# EAGLE design lola (EAGLE 9.6.1)

## Sheet 1 of 4: MCU
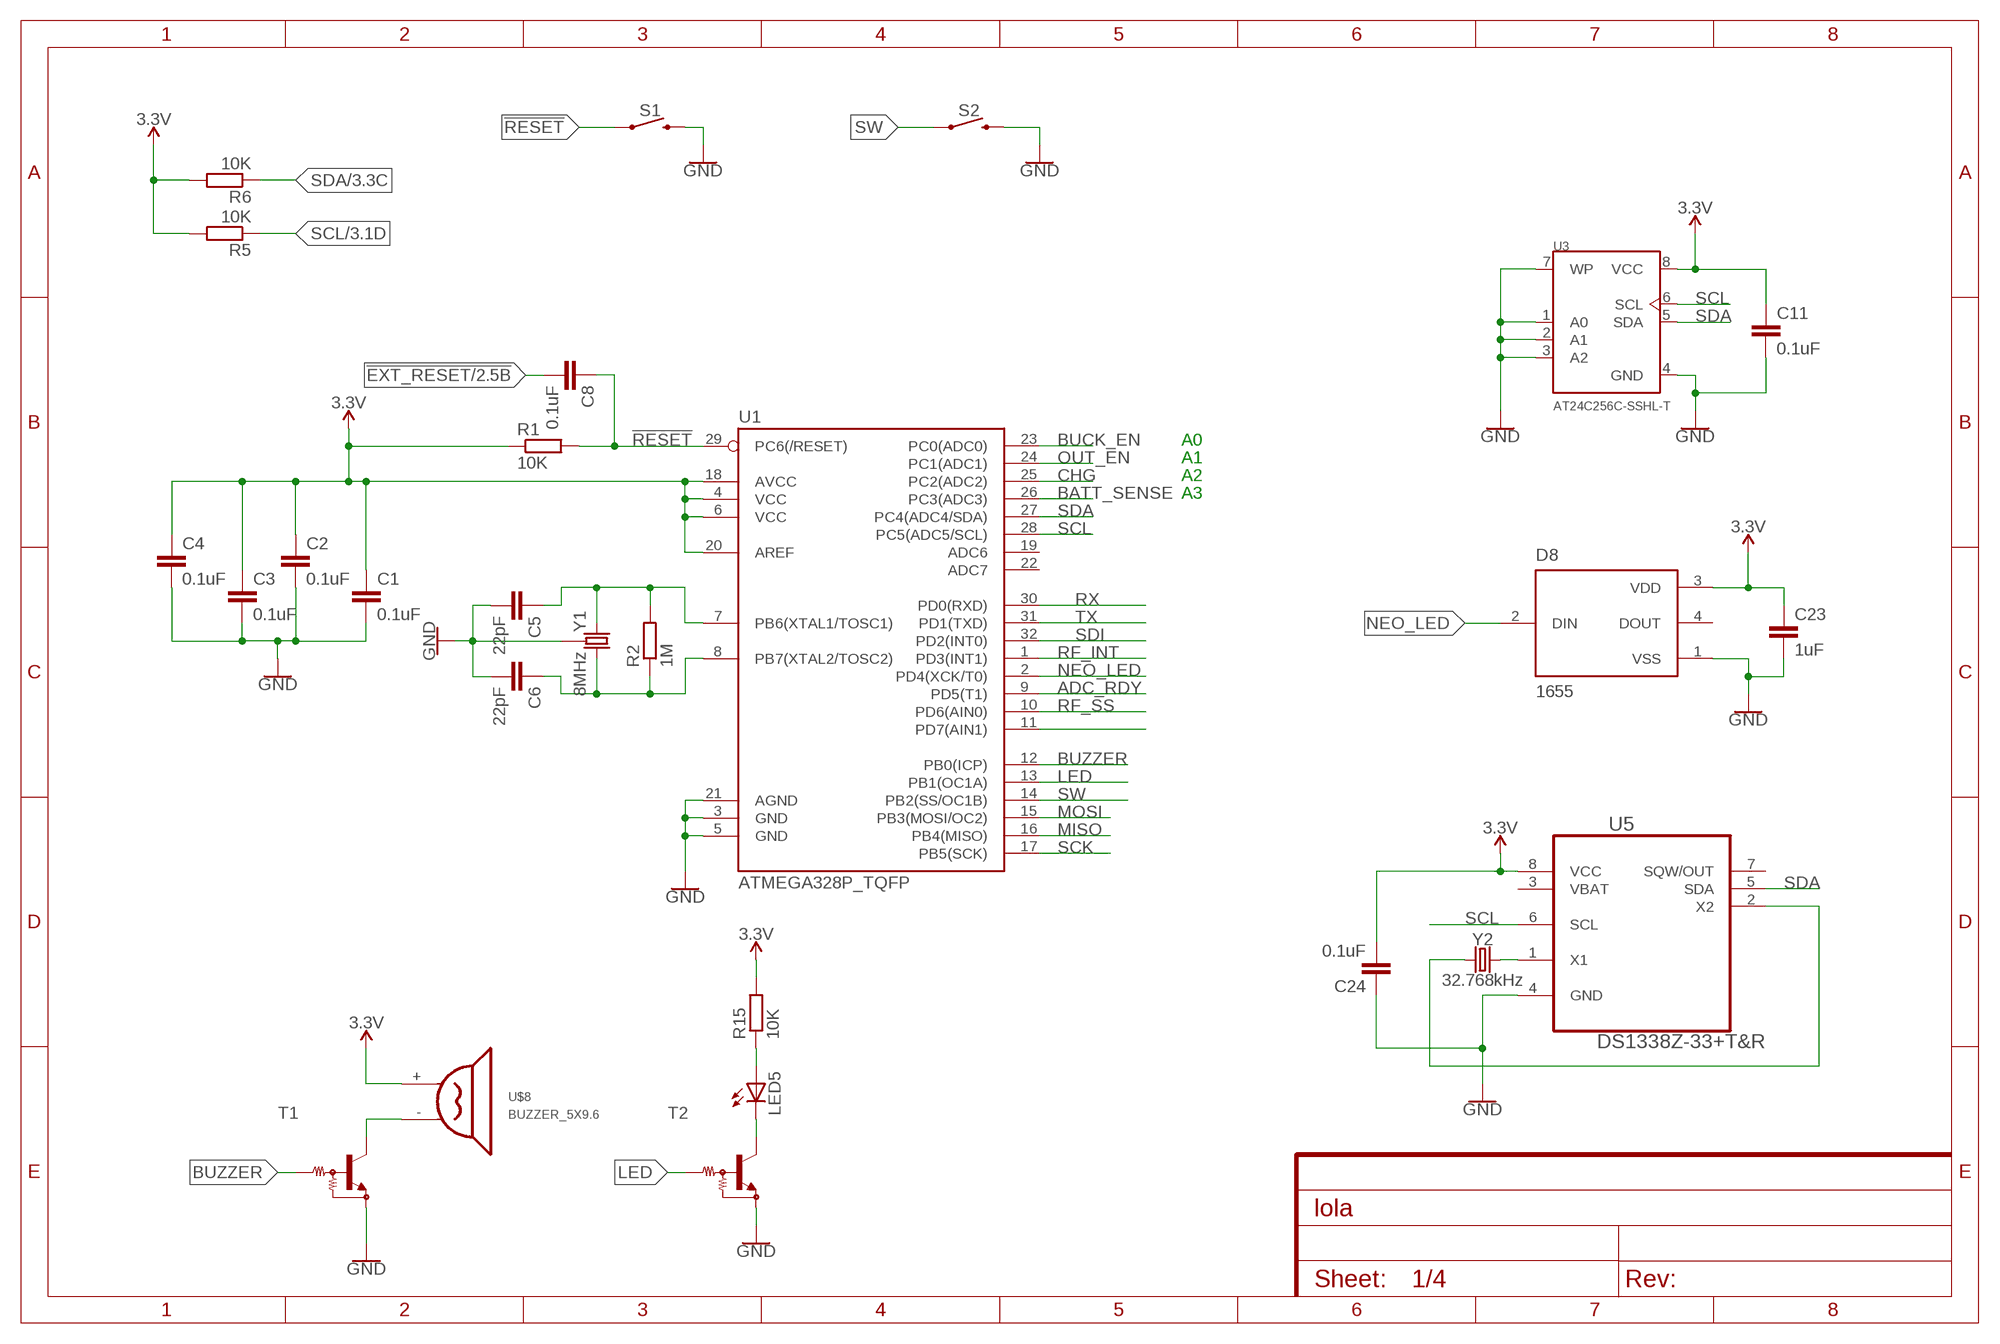
[diagram p0: schematic, sheet 1]

### Parts
C1  0.1uF  C-EUC0603  [C0603]
C2  0.1uF  C-EUC0603  [C0603]
C3  0.1uF  C-EUC0603  [C0603]
C4  0.1uF  C-EUC0603  [C0603]
C5  22pF  C-EUC0603  [C0603]
C6  22pF  C-EUC0603  [C0603]
C8  0.1uF  C-EUC0603  [C0603]
C11  0.1uF  C-EUC0603  [C0603]
C23  1uF  C-EUC0603  [C0603]
C24  0.1uF  C-EUC0603  [C0603]
D8  1655  [LED_1655]
LED5  LEDCHIPLED_0805  [CHIPLED_0805]
R1  10K  R-EU_R0603  [R0603]
R2  1M  R-EU_R0603  [R0603]
R5  10K  R-EU_R0603  [R0603]
R6  10K  R-EU_R0603  [R0603]
R15  10K  R-EU_R0603  [R0603]
S1  MOMENTARY-SWITCH-SPST-SMD-4.6X2.8MM  [TACTILE_SWITCH_SMD_4.6X2.8MM]
S2  MOMENTARY-SWITCH-SPST-SMD-4.6X2.8MM  [TACTILE_SWITCH_SMD_4.6X2.8MM]
T1  MUN2211T1-NPN_DRIVER-SC59-BEC  [SC59-BEC]
T2  MUN2211T1-NPN_DRIVER-SC59-BEC  [SC59-BEC]
U1  ATMEGA328P_TQFP  [TQFP32-08]
U3  AT24C256C-SSHL-T  [SOIC127P600X175-8N]
U5  DS1338Z-33+T&R  [SOIC127P600X175-8N]
U$8  BUZZER_5X9.6  [BUZZER_5X9.6]
Y1  8MHz  CRYSTAL-GROUNDEDSMD-5X3.2  [CRYSTAL-SMD-5X3.2-4PAD]
Y2  32.768kHz  CRYSTAL-32.768KHZSMD-3.2X1.5  [CRYSTAL-SMD-3.2X1.5MM]

### Nets
3.3V: C1.1 C2.1 C3.1 C4.1 C11.1 C23.1 C24.2 D8.3(VDD) R1.1 R5.2 R6.2 R15.2 U1.4(VCC) U1.6(VCC) U1.18(AVCC) U1.20(AREF) U3.8(VCC) U5.8(VCC) U$8.+(VCC) ; also sheet 3,4
!EXT_RESET: C8.2 ; also sheet 2
!RESET: C8.1 R1.2 S1.1 S1.2 U1.29(PC6(/RESET)) ; also sheet 3
ADC_RDY: U1.9(PD5(T1)) ; also sheet 3
BATT_SENSE: U1.26(PC3(ADC3)) ; also sheet 4
BUCK_EN: U1.23(PC0(ADC0)) ; also sheet 4
BUZZER: T1.B U1.12(PB0(ICP))
CHG: U1.25(PC2(ADC2)) ; also sheet 4
GND: C1.2 C2.2 C3.2 C4.2 C5.2 C6.2 C11.2 C23.2 C24.1 D8.1(VSS) S1.3 S1.4 S2.3 S2.4 T1.E T2.E U1.3(GND) U1.5(GND) U1.21(AGND) U3.1(A0) U3.2(A1) U3.3(A2) U3.4(GND) U3.7(WP) U5.4(GND) Y1.2 Y1.4 ; also sheet 2,3,4
LED: T2.B U1.13(PB1(OC1A))
MISO: U1.16(PB4(MISO)) ; also sheet 3
MOSI: U1.15(PB3(MOSI/OC2)) ; also sheet 3
N$4: LED5.A R15.1
N$6: U5.1(X1) Y2.P$2
N$7: U5.2(X2) Y2.P$1
N$9: LED5.C T2.C
N$11: T1.C U$8.-(GND)
N$13: U1.11(PD7(AIN1))
N$17: C5.1 R2.2 U1.7(PB6(XTAL1/TOSC1)) Y1.3
N$18: C6.1 R2.1 U1.8(PB7(XTAL2/TOSC2)) Y1.1
NEO_LED: D8.2(DIN) U1.2(PD4(XCK/T0))
OUT_EN: U1.24(PC1(ADC1)) ; also sheet 3,4
RF_INT: U1.1(PD3(INT1)) ; also sheet 3
RF_SS: U1.10(PD6(AIN0)) ; also sheet 3
RX: U1.30(PD0(RXD)) ; also sheet 2
SCK: U1.17(PB5(SCK)) ; also sheet 3
SCL: R5.1 U1.28(PC5(ADC5/SCL)) U3.6(SCL) U5.6(SCL) ; also sheet 3
SDA: R6.1 U1.27(PC4(ADC4/SDA)) U3.5(SDA) U5.5(SDA) ; also sheet 3
SDI: U1.32(PD2(INT0)) ; also sheet 3
SW: S2.1 S2.2 U1.14(PB2(SS/OC1B))
TX: U1.31(PD1(TXD)) ; also sheet 2
Unconnected: D8.4(DOUT) U1.19(ADC6) U1.22(ADC7) U5.7(SQW/OUT)

### Notes on the sheet
- A0
- A1
- A2
- A3

## Sheet 2 of 4: USART
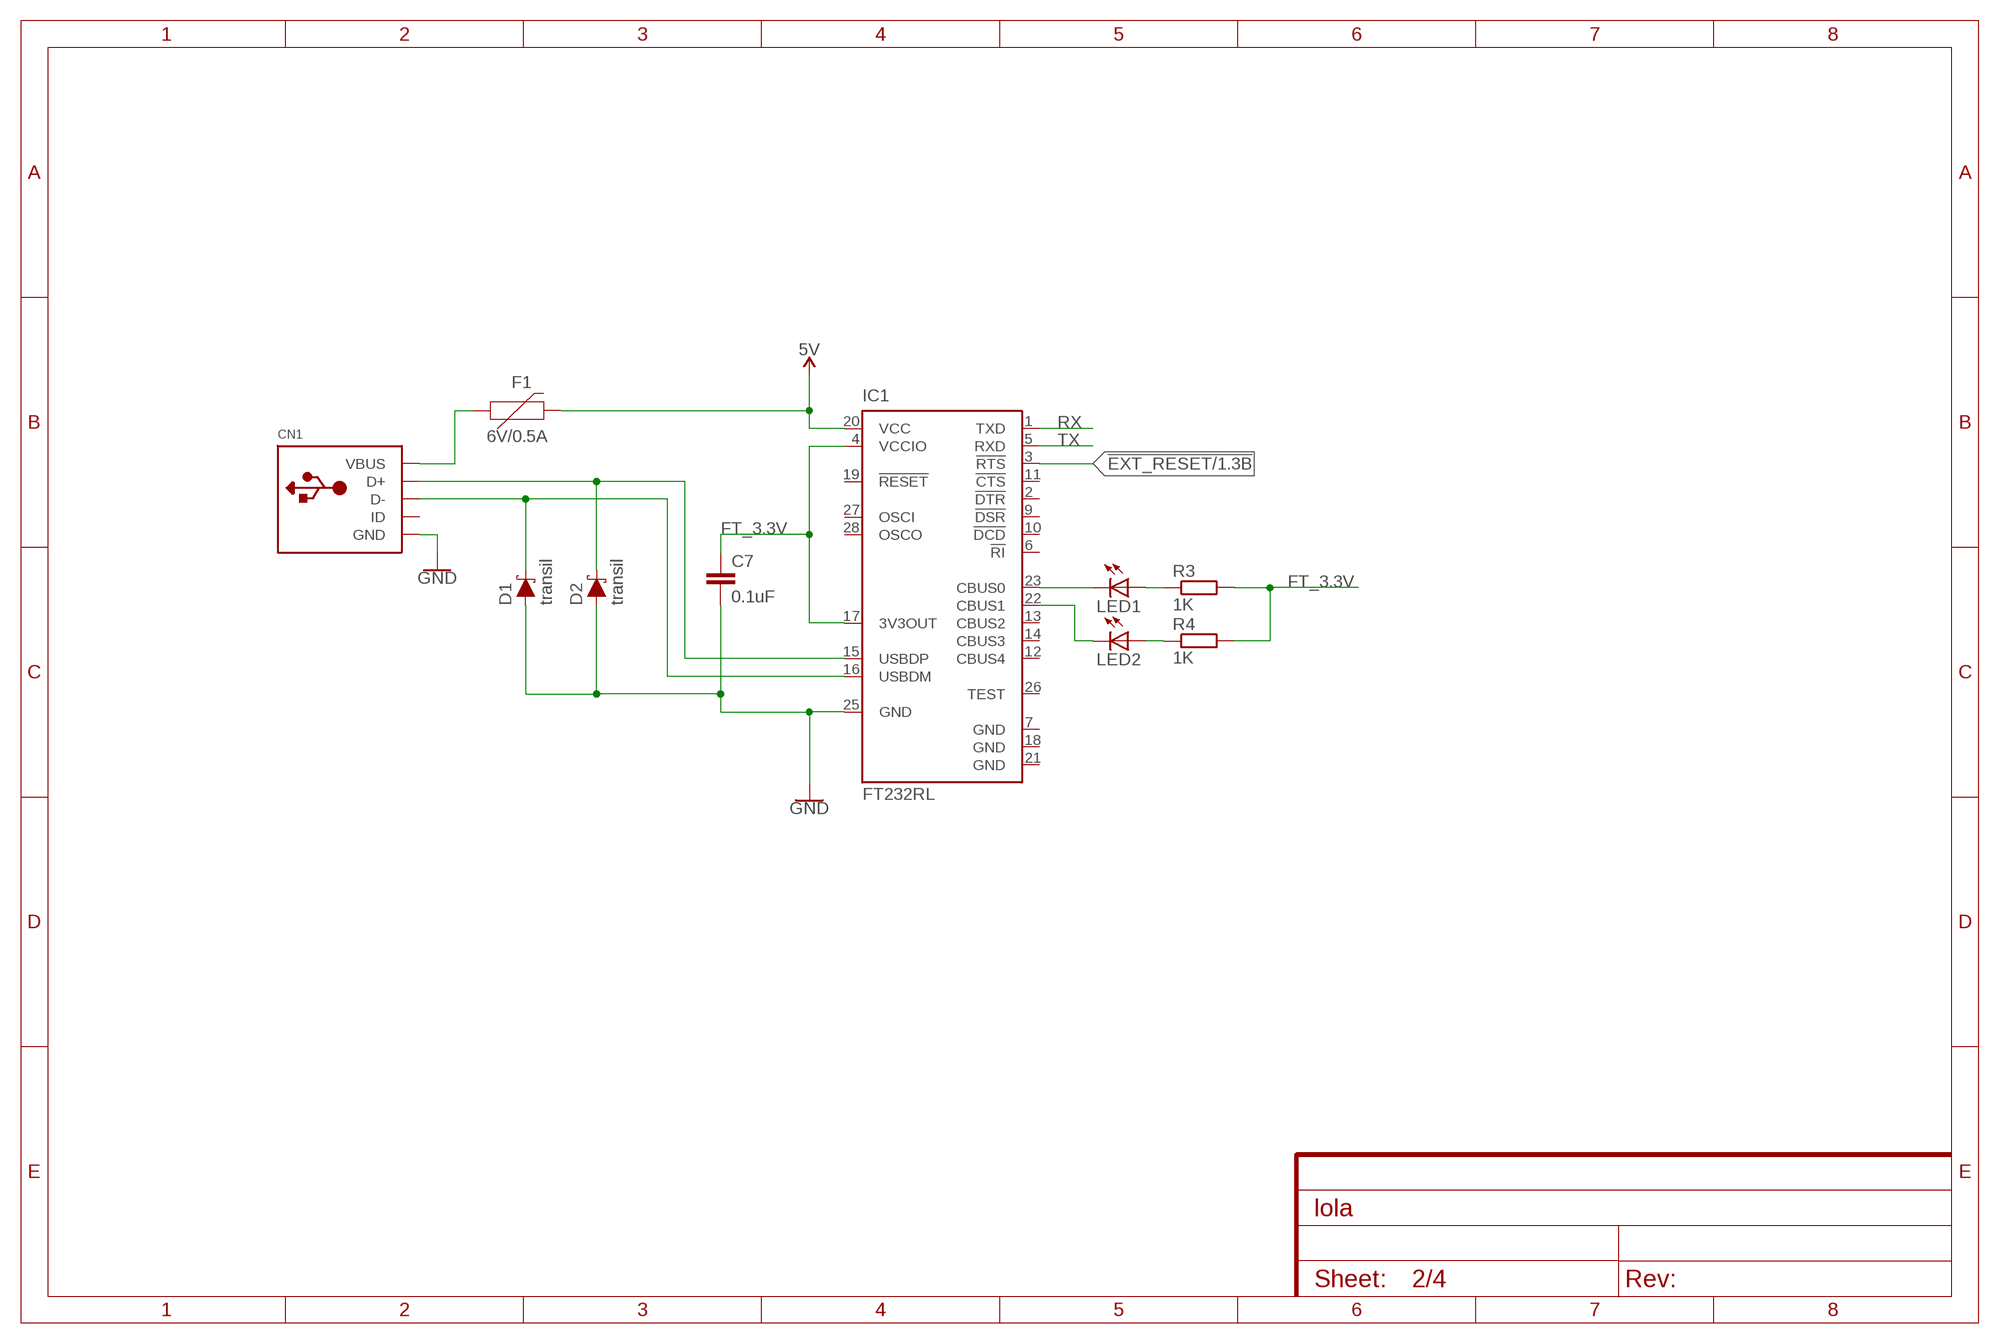
[diagram p1: schematic, sheet 2]

### Parts
C7  0.1uF  C-EUC0603  [C0603]
CN1  USBMINIB  [USB-MINIB]
D1  transil  DIODE-SCHOTTKY-BAT20J  [SOD-323]
D2  transil  DIODE-SCHOTTKY-BAT20J  [SOD-323]
F1  6V/0.5A  PPTC_HALF-AMP  [1206]
IC1  FT232RL  [SSOP28]
LED1  LEDCHIPLED_0805  [CHIPLED_0805]
LED2  LEDCHIPLED_0805  [CHIPLED_0805]
R3  1K  R-EU_R0603  [R0603]
R4  1K  R-EU_R0603  [R0603]

### Nets
5V: F1.2 IC1.20(VCC) ; also sheet 4
!EXT_RESET: IC1.3(!RTS) ; also sheet 1
FT_3.3V: C7.1 IC1.4(VCCIO) IC1.17(3V3OUT) R3.2 R4.2
GND: C7.2 CN1.GND D1.A D2.A IC1.25(GND) ; also sheet 1,3,4
N$20: CN1.VBUS F1.1
N$21: CN1.D+ D2.C IC1.15(USBDP)
N$22: CN1.D- D1.C IC1.16(USBDM)
N$23: LED2.A R4.1
N$24: IC1.22(CBUS1) LED2.C
N$25: IC1.23(CBUS0) LED1.C
N$26: LED1.A R3.1
RX: IC1.1(TXD) ; also sheet 1
TX: IC1.5(RXD) ; also sheet 1
Unconnected: CN1.ID IC1.2(!DTR) IC1.6(!RI) IC1.9(!DSR) IC1.10(!DCD) IC1.11(!CTS) IC1.12(CBUS4) IC1.13(CBUS2) IC1.14(CBUS3) IC1.19(!RESET) IC1.26(TEST) IC1.27(OSCI) IC1.28(OSCO)

## Sheet 3 of 4: Modules
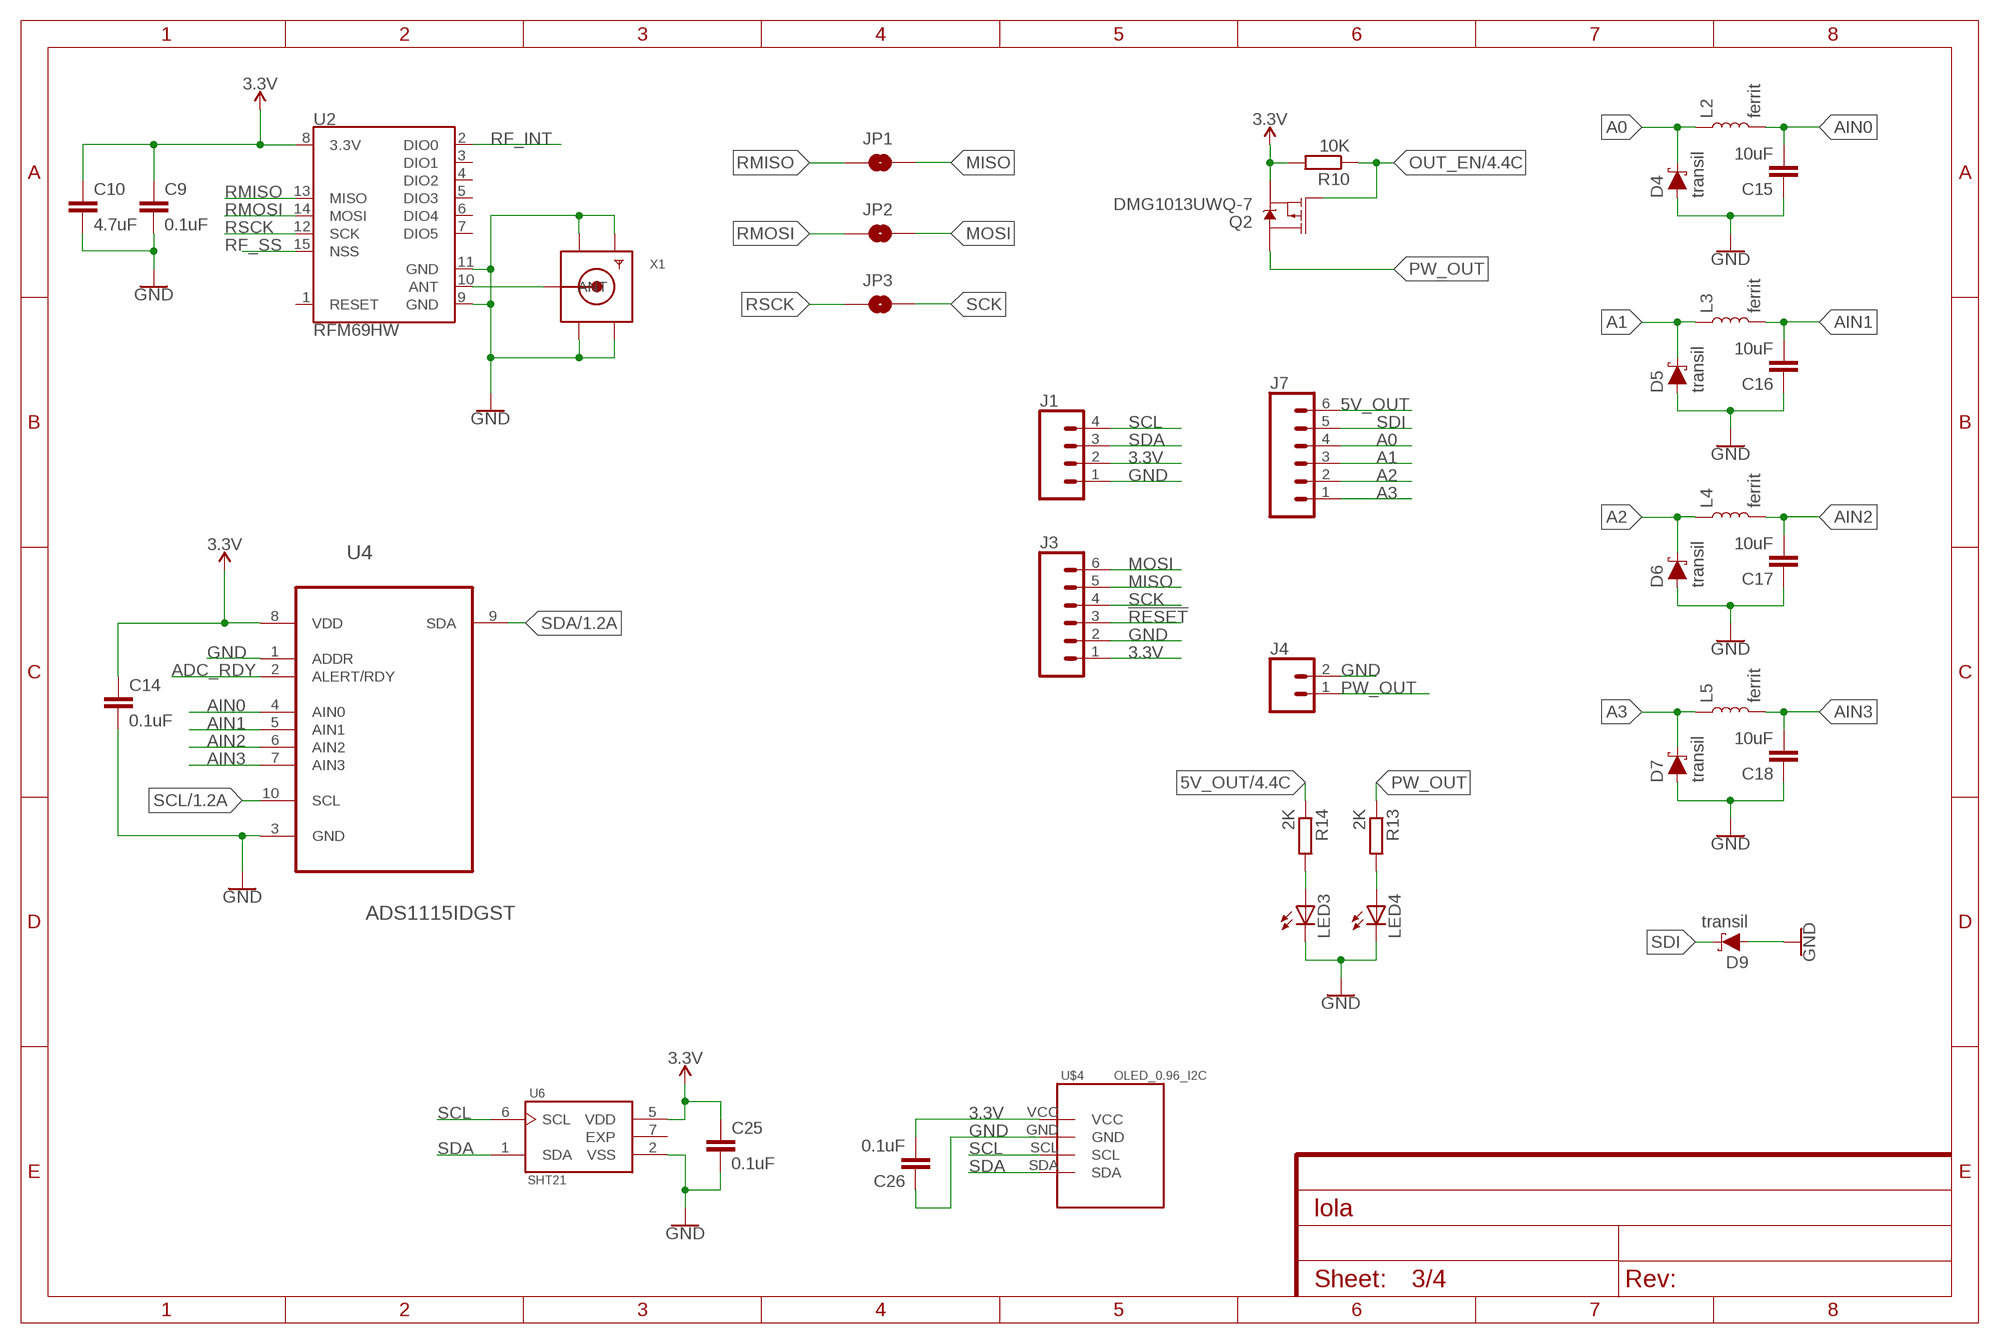
[diagram p2: schematic, sheet 3]

### Parts
C9  0.1uF  C-EUC0603  [C0603]
C10  4.7uF  C-EUC0603  [C0603]
C14  0.1uF  C-EUC0603  [C0603]
C15  10uF  C-EUC0603  [C0603]
C16  10uF  C-EUC0603  [C0603]
C17  10uF  C-EUC0603  [C0603]
C18  10uF  C-EUC0603  [C0603]
C25  0.1uF  C-EUC0603  [C0603]
C26  0.1uF  C-EUC0603  [C0603]
D4  transil  DIODE-SCHOTTKY-BAT20J  [SOD-323]
D5  transil  DIODE-SCHOTTKY-BAT20J  [SOD-323]
D6  transil  DIODE-SCHOTTKY-BAT20J  [SOD-323]
D7  transil  DIODE-SCHOTTKY-BAT20J  [SOD-323]
D9  transil  DIODE-SCHOTTKY-BAT20J  [SOD-323]
J1  CONN_04LOCK_LONGPADS  [1X04_LOCK_LONGPADS]
J3  CONN_06NO_SILK_FEMALE_PTH  [1X06_NO_SILK]
J4  CONN_025MM  [SCREWTERMINAL-5MM-2]
J7  CONN_063.5MM-6  [SCREWTERMINAL-3.5MM-6]
JP1  JUMPER-SMT_2_NO_NO-SILK  [SMT-JUMPER_2_NO_NO-SILK]
JP2  JUMPER-SMT_2_NO_NO-SILK  [SMT-JUMPER_2_NO_NO-SILK]
JP3  JUMPER-SMT_2_NO_NO-SILK  [SMT-JUMPER_2_NO_NO-SILK]
L2  ferrit  INDUCTOR-0603-33NH  [0603]
L3  ferrit  INDUCTOR-0603-33NH  [0603]
L4  ferrit  INDUCTOR-0603-33NH  [0603]
L5  ferrit  INDUCTOR-0603-33NH  [0603]
LED3  LEDCHIPLED_0805  [CHIPLED_0805]
LED4  LEDCHIPLED_0805  [CHIPLED_0805]
Q2  DMG1013UWQ-7  MOSFET_PCH-DMG2307L  [SOT23-3]
R10  10K  R-EU_R0603  [R0603]
R13  2K  R-EU_R0603  [R0603]
R14  2K  R-EU_R0603  [R0603]
U2  RFM69HW  [RFM69W-XXXS2]
U4  ADS1115IDGST  [SOP50P490X110-10N]
U6  SHT21  [SON100P300X300X110-7N]
U$4  OLED_0.96_I2C  [OLED_0.96_I2C]
X1  SMACONNECTOR_EDGE_UFL  [SMA_EDGELAUNCH_UFL]

### Nets
3.3V: C9.1 C10.1 C14.1 C25.1 C26.2 J1.2 J3.1 Q2.2(S) R10.2 U2.8(3.3V) U4.8(VDD) U6.5(VDD) U$4.VCC ; also sheet 1,4
5V_OUT: J7.6 R14.1 ; also sheet 4
!RESET: J3.3 ; also sheet 1
A0: D4.C J7.4 L2.1
A1: D5.C J7.3 L3.1
A2: D6.C J7.2 L4.1
A3: D7.C J7.1 L5.1
ADC_RDY: U4.2(ALERT/RDY) ; also sheet 1
AIN0: C15.2 L2.2 U4.4(AIN0)
AIN1: C16.2 L3.2 U4.5(AIN1)
AIN2: C17.2 L4.2 U4.6(AIN2)
AIN3: C18.2 L5.2 U4.7(AIN3)
GND: C9.2 C10.2 C14.2 C15.1 C16.1 C17.1 C18.1 C25.2 C26.1 D4.A D5.A D6.A D7.A D9.A J1.1 J3.2 J4.2 LED3.C LED4.C U2.9(GND) U2.11(GND) U4.1(ADDR) U4.3(GND) U6.2(VSS) U$4.GND X1.GND@1(GND1) X1.GND@2(GND2) X1.GND@3(GND3) X1.GND@4(GND4) ; also sheet 1,2,4
MISO: J3.5 JP1.2 ; also sheet 1
MOSI: J3.6 JP2.2 ; also sheet 1
N$1: U2.10(ANT) X1.P(ANT)
N$5: LED3.A R14.2
N$8: LED4.A R13.2
OUT_EN: Q2.1(G) R10.1 ; also sheet 1,4
PW_OUT: J4.1 Q2.3(D) R13.1
RF_INT: U2.2(DIO0) ; also sheet 1
RF_SS: U2.15(NSS) ; also sheet 1
RMISO: JP1.1 U2.13(MISO)
RMOSI: JP2.1 U2.14(MOSI)
RSCK: JP3.1 U2.12(SCK)
SCK: J3.4 JP3.2 ; also sheet 1
SCL: J1.4 U4.10(SCL) U6.6(SCL) U$4.SCL ; also sheet 1
SDA: J1.3 U4.9(SDA) U6.1(SDA) U$4.SDA ; also sheet 1
SDI: D9.C J7.5 ; also sheet 1
Unconnected: U2.1(RESET) U2.3(DIO1) U2.4(DIO2) U2.5(DIO3) U2.6(DIO4) U2.7(DIO5)

## Sheet 4 of 4: Supply
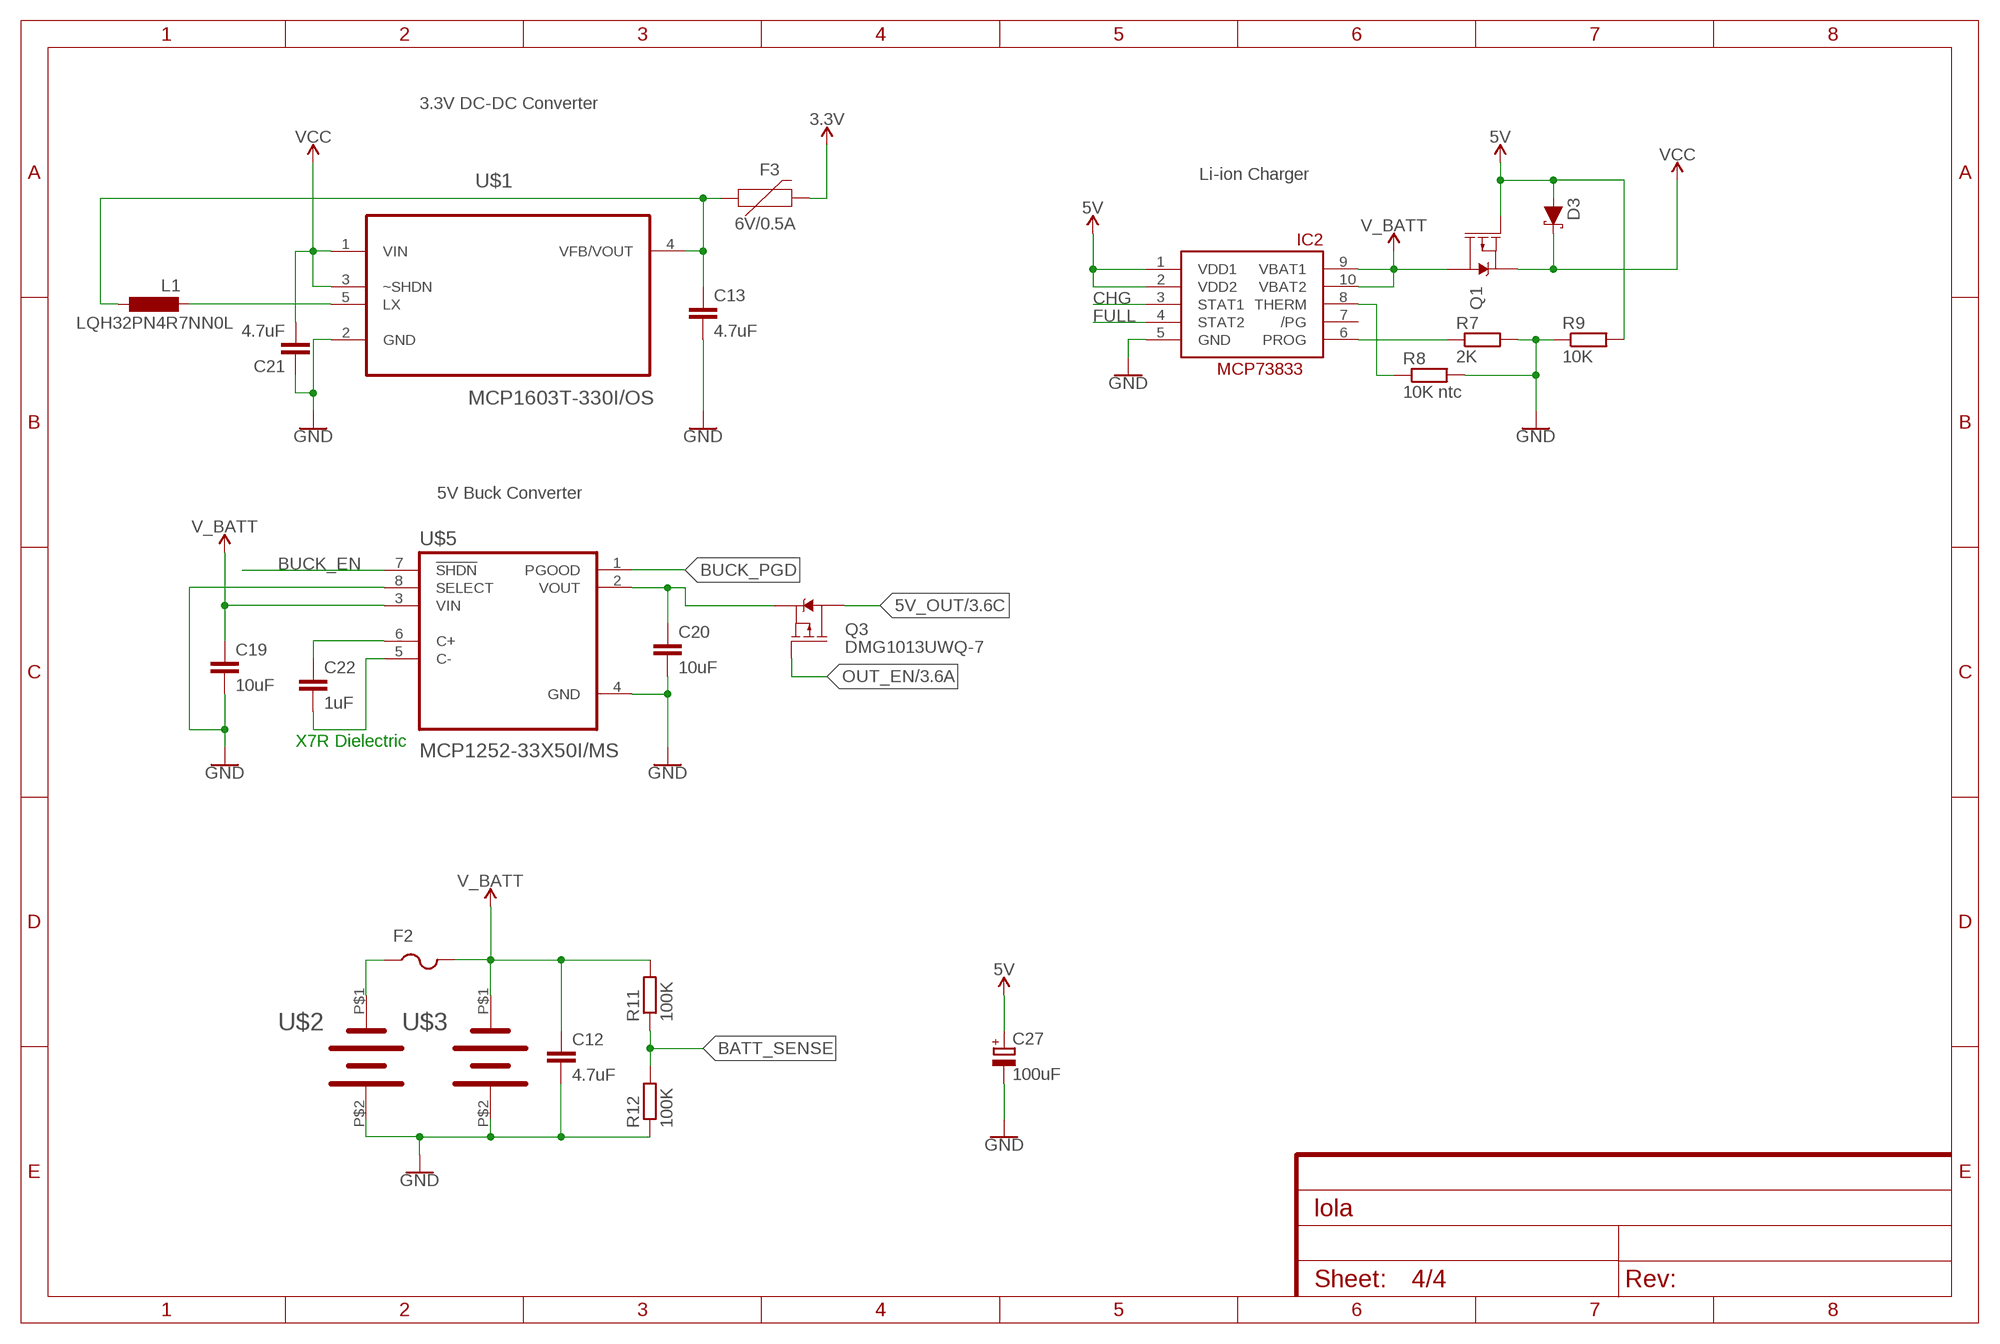
[diagram p3: schematic, sheet 4]

### Parts
C12  4.7uF  C-EUC0603  [C0603]
C13  4.7uF  C-EUC1206  [C1206]
C19  10uF  C-EUC1206  [C1206]
C20  10uF  C-EUC1206  [C1206]
C21  4.7uF  C-EUC1206  [C1206]
C22  1uF  C-EUC0805  [C0805]
C27  100uF  CPOL-EUCT6032  [CT6032]
D3  DIODE-SCHOTTKY-B340A  [SMA-DIODE]
F2  PTCFUSE-1812  [1812]
F3  6V/0.5A  PPTC_HALF-AMP  [1206]
IC2  MCP73833-UN  [MSOP10]
L1  LQH32PN4R7NN0L  L-EUL1812  [L1812]
Q1  MOSFET_PCH-DMG2307L  [SOT23-3]
Q3  DMG1013UWQ-7  MOSFET_PCH-DMG2307L  [SOT23-3]
R7  2K  R-EU_R0603  [R0603]
R8  10K ntc  R-EU_R0603  [R0603]
R9  10K  R-EU_R0603  [R0603]
R11  100K  R-EU_R0603  [R0603]
R12  100K  R-EU_R0603  [R0603]
U$1  MCP1603T-330I/OS  [SOT95P280X110-5N]
U$2  COMF_BHC-18650-1P  [MR18650_HOLDER]
U$3  COMF_BHC-18650-1P  [MR18650_HOLDER]
U$5  MCP1252-33X50I/MS  [SOP65P490X110-8N]

### Nets
3.3V: F3.2 ; also sheet 1,3
5V: C27.-(+) D3.A IC2.1(VDD1) IC2.2(VDD2) Q1.1(G) R9.2 ; also sheet 2
5V_OUT: Q3.3(D) ; also sheet 3
BATT_SENSE: R11.1 R12.2 ; also sheet 1
BUCK_EN: U$5.7(!SHDN) ; also sheet 1
BUCK_PGD: U$5.1(PGOOD)
CHG: IC2.3(STAT1) ; also sheet 1
FULL: IC2.4(STAT2)
GND: C12.2 C13.2 C19.2 C20.2 C21.1 C27.+(-) IC2.5(GND) R7.2 R8.2 R9.1 R12.1 U$1.2(GND) U$2.P$2(GND) U$3.P$2(GND) U$5.4(GND) U$5.8(SELECT) ; also sheet 1,2,3
N$2: F2.1 U$2.P$1(BAT)
N$3: C13.1 F3.1 L1.1 U$1.4(VFB/VOUT)
N$19: IC2.8(THERM) R8.1
N$28: IC2.6(PROG) R7.1
N$29: L1.2 U$1.5(LX)
N$30: C20.1 Q3.2(S) U$5.2(VOUT)
N$31: C22.1 U$5.6(C+)
N$32: C22.2 U$5.5(C-)
OUT_EN: Q3.1(G) ; also sheet 1,3
V_BATT: C12.1 C19.1 F2.2 IC2.9(VBAT1) IC2.10(VBAT2) Q1.3(D) R11.2 U$3.P$1(BAT) U$5.3(VIN)
VCC: C21.2 D3.C Q1.2(S) U$1.1(VIN) U$1.3(~SHDN)
Unconnected: IC2.7(/PG)

### Notes on the sheet
- 3.3V DC-DC Converter
- Li-ion Charger
- 5V Buck Converter
- X7R Dielectric

## Power pins joined to a net without a drawn wire
EXP: U6.7(EXP)
GND: IC1.7(GND) IC1.18(GND) IC1.21(GND)
VBAT: U5.3(VBAT)

## Library data of the parts
C1-C26 = resistor:C-EU: CAPACITOR, European symbol
C27 = resistor:CPOL-EU: POLARIZED CAPACITOR, European symbol
CN1 = adafruit:USB: USB Connectors USBMINIB - Surface Mount Female Mini-B USB Connector 4UConnector: 06564 By microbuilder.eu Thru-hole RA Female Mini-B USB Connector 4UConnector: 18732 By ladyada.net
D1 D2 D4-D7 D9 = SparkFun-DiscreteSemi:DIODE-SCHOTTKY: Schottky diode A Schottky diode is a semiconductor diode which has a low forward voltage drop and a very fast switching action.; PROD_ID: DIO-11623; VALUE: 1A/23V/620mV
D3 = SparkFun-DiscreteSemi:DIODE-SCHOTTKY: Schottky diode A Schottky diode is a semiconductor diode which has a low forward voltage drop and a very fast switching action.; PROD_ID: DIO-09886; VALUE: 3A/40V/500mV
D8 = 1655:1655: Ws2812b 5050 Rgb Led With Integrated Driver Chip Pack Of 10; AVAILABILITY: Unavailable; DESCRIPTION: Addressable Lighting Neopixel 10 LED Discrete Serial _Shift Register_ Red, Green, Blue _RGB_ 5.00mm L x 5.00mm W; MF: Adafruit Industries; MP: 1655; PACKAGE: TSOP-38238 Adafruit Industries; PRICE: None
F1 F3 = SparkFun-Fuses:PPTC: Resettable Fuse PPTC Resettable Fuse. Really a sort of resistor with a polymeric positive temperature coefficient whose resistance increases dramatically with an increase in temperature. When heated by the power passing through the resistance rises causing the current to be limited, protecting the circuit. This is achieved by the transition of the polymer from a crystalline to an amorphous state where the conductive carbon separates breaking the conductive pathways found in the cool crystalline structure. When a PPTC cools back down it resumes conducting letting the circuit turn back on. SparkFun Products: SparkFun RedBoard - Programmed with Arduino <https://www.sparkfun.com/products/12757> Pro Micro - 5V/16MHz <https://www.sparkfun.com/products/12640> Arduino Pro 328 - 5V/16MHz <https://www.sparkfun.com/products/10915> MP3 Trigger <https://www.sparkfun.com/products/13720>; PROD_ID: RES-08585
F2 = adafruit:PTCFUSE: PTC fuses, resettable thermistors
IC1 = ftdichip:FT232R: Source: http://www.ftdichip.com/Documents/DataSheets/DS_FT232R_v104.pdf; MPN: FT232RL; OC_FARNELL: 1146032; OC_NEWARK: 91K9918
IC2 = adafruit:MCP73833
J1 = SparkFun-Connectors:CONN_04: Multi connection point. Often used as Generic Header-pin footprint for 0.1 inch spaced/style header connections On any of the 0.1 inch spaced packages, you can populate with these: Break Away Headers - Straight <https://www.sparkfun.com/products/116> (PRT-00116) Break Away Male Headers - Right Angle <https://www.sparkfun.com/products/553> (PRT-00553) Female Headers <https://www.sparkfun.com/products/115> (PRT-00115) Break Away Headers - Machine Pin <https://www.sparkfun.com/products/117> (PRT-00117) Break Away Female Headers - Swiss Machine Pin <https://www.sparkfun.com/products/743> (PRT-00743) For SCREWTERMINALS and SPRING TERMINALS visit here: Screw Terimnals on SparkFun.com <https://www.sparkfun.com/search/results?term=Screw+Terminals> (5mm/3.5mm/2.54mm spacing) This device is also useful as a general connection point to wire up your design to another part of your project. Our various solder wires solder well into these plated through hole pads. Hook-Up Wire - Assortment (Stranded, 22 AWG) <https://www.sparkfun.com/products/11375> (PRT-11375) Hook-Up Wire - Assortment (Solid Core, 22 AWG) <https://www.sparkfun.com/products/11367> (PRT-11367) View the entire wire category on our website here <https://www.sparkfun.com/categories/141> Special notes: Molex polarized connector foot print use with SKU : PRT-08231 with associated crimp pins and housings. 1MM SMD Version SKU: PRT-10208; PROD_ID: CONN-09696
J3 = SparkFun-Connectors:CONN_06: Multi connection point. Often used as Generic Header-pin footprint for 0.1 inch spaced/style header connections On any of the 0.1 inch spaced packages, you can populate with these: Break Away Headers - Straight <https://www.sparkfun.com/products/116> (PRT-00116) Break Away Male Headers - Right Angle <https://www.sparkfun.com/products/553> (PRT-00553) Female Headers <https://www.sparkfun.com/products/115> (PRT-00115) Break Away Headers - Machine Pin <https://www.sparkfun.com/products/117> (PRT-00117) Break Away Female Headers - Swiss Machine Pin <https://www.sparkfun.com/products/743> (PRT-00743) Arduino Stackable Header - 6 Pin <https://www.sparkfun.com/products/9280> (PRT-09280) For SCREWTERMINALS and SPRING TERMINALS visit here: Screw Terimnals on SparkFun.com <https://www.sparkfun.com/search/results?term=Screw+Terminals> (5mm/3.5mm/2.54mm spacing) This device is also useful as a general connection point to wire up your design to another part of your project. Our various solder wires solder well into these plated through hole pads. Hook-Up Wire - Assortment (Stranded, 22 AWG) <https://www.sparkfun.com/products/11375> (PRT-11375) Hook-Up Wire - Assortment (Solid Core, 22 AWG) <https://www.sparkfun.com/products/11367> (PRT-11367) View the entire wire category on our website here <https://www.sparkfun.com/categories/141>; PROD_ID: CONN-08437
J4 = SparkFun-Connectors:CONN_02: Multi connection point. Often used as Generic Header-pin footprint for 0.1 inch spaced/style header connections On any of the 0.1 inch spaced packages, you can populate with these: Break Away Headers - Straight <https://www.sparkfun.com/products/116> (PRT-00116) Break Away Male Headers - Right Angle <https://www.sparkfun.com/products/553> (PRT-00553) Female Headers <https://www.sparkfun.com/products/115> (PRT-00115) Break Away Headers - Machine Pin <https://www.sparkfun.com/products/117> (PRT-00117) Break Away Female Headers - Swiss Machine Pin <https://www.sparkfun.com/products/743> (PRT-00743) For SCREWTERMINALS and SPRING TERMINALS visit here: Screw Terimnals on SparkFun.com <https://www.sparkfun.com/search/results?term=Screw+Terminals> (5mm/3.5mm/2.54mm spacing) This device is also useful as a general connection point to wire up your design to another part of your project. Our various solder wires solder well into these plated through hole pads. Hook-Up Wire - Assortment (Stranded, 22 AWG) <https://www.sparkfun.com/products/11375> (PRT-11375) Hook-Up Wire - Assortment (Solid Core, 22 AWG) <https://www.sparkfun.com/products/11367> (PRT-11367) View the entire wire category on our website here <https://www.sparkfun.com/categories/141> Special notes: Molex polarized connector foot print use with: PRT-08233 with associated crimp pins and housings. 2.54_SCREWTERM for use with PRT-10571. 3.5mm Screw Terminal footprints for PRT-08084 5mm Screw Terminal footprints for use with PRT-08432; SF_SKU: PRT-08432
J7 = SparkFun-Connectors:CONN_06: Multi connection point. Often used as Generic Header-pin footprint for 0.1 inch spaced/style header connections On any of the 0.1 inch spaced packages, you can populate with these: Break Away Headers - Straight <https://www.sparkfun.com/products/116> (PRT-00116) Break Away Male Headers - Right Angle <https://www.sparkfun.com/products/553> (PRT-00553) Female Headers <https://www.sparkfun.com/products/115> (PRT-00115) Break Away Headers - Machine Pin <https://www.sparkfun.com/products/117> (PRT-00117) Break Away Female Headers - Swiss Machine Pin <https://www.sparkfun.com/products/743> (PRT-00743) Arduino Stackable Header - 6 Pin <https://www.sparkfun.com/products/9280> (PRT-09280) For SCREWTERMINALS and SPRING TERMINALS visit here: Screw Terimnals on SparkFun.com <https://www.sparkfun.com/search/results?term=Screw+Terminals> (5mm/3.5mm/2.54mm spacing) This device is also useful as a general connection point to wire up your design to another part of your project. Our various solder wires solder well into these plated through hole pads. Hook-Up Wire - Assortment (Stranded, 22 AWG) <https://www.sparkfun.com/products/11375> (PRT-11375) Hook-Up Wire - Assortment (Solid Core, 22 AWG) <https://www.sparkfun.com/products/11367> (PRT-11367) View the entire wire category on our website here <https://www.sparkfun.com/categories/141>
JP1-JP3 = SparkFun-Jumpers:JUMPER-SMT_2_NO: Normally open jumper This jumper has two pads in close proximity to each other. Apply solder to close the connection. Round pads are easier to solder for beginners, but are a lot larger. SparkFun Product that uses the round pads: SparkFun EL Sequencer <https://www.sparkfun.com/products/12781>
L1 = rcl:L-EU: INDUCTOR, European symbol; SPICEPREFIX: L
L2-L5 = SparkFun-Coils:INDUCTOR: Inductors Resist changes in electrical current. Basically a coil of wire. SparkFun Products: SparkFun Load Cell Amplifier - HX711 <https://www.sparkfun.com/products/13879> IOIO-OTG - V2.2 <https://www.sparkfun.com/products/13613>; PROD_ID: NDUC-07874; VALUE: 33nH/±5%/500mA
LED1-LED5 = adafruit:LED: LED OSRAM: - CHIPLED LG R971, LG N971, LY N971, LG Q971, LY Q971, LO R971, LY R971 LH N974, LH R974 LS Q976, LO Q976, LY Q976 LO Q996 - Hyper CHIPLED LW Q18S LB Q993, LB Q99A, LB R99A - SideLED LS A670, LO A670, LY A670, LG A670, LP A670 LB A673, LV A673, LT A673, LW A673 LH A674 LY A675 LS A676, LA A676, LO A676, LY A676, LW A676 LS A679, LY A679, LG A679 - Hyper Micro SIDELED® LS Y876, LA Y876, LO Y876, LY Y876 LT Y87S - SmartLED LW L88C, LW L88S LB L89C, LB L89S, LG L890 LS L89K, LO L89K, LY L89K LS L896, LA L896, LO L896, LY L896 - TOPLED LS T670, LO T670, LY T670, LG T670, LP T670 LSG T670, LSP T670, LSY T670, LOP T670, LYG T670 LG T671, LOG T671, LSG T671 LB T673, LV T673, LT T673, LW T673 LH T674 LS T676, LA T676, LO T676, LY T676, LB T676, LH T676, LSB T676, LW T676 LB T67C, LV T67C, LT T67C, LS T67K, LO T67K, LY T67K, LW E67C LS E67B, LA E67B, LO E67B, LY E67B, LB E67C, LV E67C, LT E67C LW T67C LS T679, LY T679, LG T679 LS T770, LO T770, LY T770, LG T770, LP T770 LB T773, LV T773, LT T773, LW T773 LH T774 LS E675, LA E675, LY E675, LS T675 LS T776, LA T776, LO T776, LY T776, LB T776 LHGB T686 LT T68C, LB T68C - Hyper Mini TOPLED® LB M676 - Mini TOPLED Santana® LG M470 LS M47K, LO M47K, LY M47K Source: http://www.osram.convergy.de/
Q1-Q3 = SparkFun-DiscreteSemi:MOSFET_PCH: P-channel MOSFETs Voltage controlled devices that allow control of high current outputs. SparkFun Products: SparkFun ESP32 Thing <https://www.sparkfun.com/products/13907> SparkFun ESP8266 Thing <https://www.sparkfun.com/products/13231>; PROD_ID: TRANS-11308; VALUE: 2.5A/30V/105mΩ
R1-R15 = resistor:R-EU_: RESISTOR, European symbol
S1 S2 = SparkFun-Switches:MOMENTARY-SWITCH-SPST: Momentary Switch (Pushbutton) - SPST Normally-open (NO) SPST momentary switches (buttons, pushbuttons). Variants PTH-12MM - 12mm square, through-hole Momentary Pushbutton Switch - 12mm Square <https://www.sparkfun.com/products/9190> (COM-09190) PTH-6.0MM, PTH-6.0MM-KIT - 6.0mm square, through-hole Mini Pushbutton Switch <https://www.sparkfun.com/products/97> (COM-00097) KIT package intended for soldering kit's - only one side of pads' copper is exposed. PTH-RIGHT-ANGLE-KIT - Right-angle, through-hole Right Angle Tactile Button <https://www.sparkfun.com/products/10791> - Used on SparkFun BigTime Watch Kit <https://www.sparkfun.com/products/11734> SMD-12MM - 12mm square, surface-mount Tactile Button - SMD (12mm) <https://www.sparkfun.com/products/12993> (COM-12993) Used on SparkFun PicoBoard <https://www.sparkfun.com/products/11888> SMD-4.5MM - 4.5mm Square Trackball Switch Used on SparkFun Blackberry Trackballer Breakout <https://www.sparkfun.com/products/13169> SMD-4.6MMX2.8MM - 4.60mm x 2.80mm, surface mount Used on SparkFun SAMD21 Mini Breakout <https://www.sparkfun.com/products/13664> SMD-5.2MM, SMD-5.2-REDUNDANT - 5.2mm square, surface-mount Mini Pushbutton Switch - SMD <https://www.sparkfun.com/products/8720> (COM-08720) Used on Arduino Pro Mini <https://www.sparkfun.com/products/11114> REDUNDANT package connects both switch circuits together SMD-6.0X3.5MM - 6.0 x 3.5mm, surface mount Momentary Reset Switch SMD <https://www.sparkfun.com/products/8229> (COM-08229) SMD-6.2MM-TALL - 6.2mm square, surface mount Tactile Button - SMD (6mm) <https://www.sparkfun.com/products/12992> Used on SparkFun Digital Sandbox <https://www.sparkfun.com/products/12651> SMD-RIGHT-ANGLE - Right-angle, surface mount Used on SparkFun Block for Intel® Edison - Arduino <https://www.sparkfun.com/products/13036>; PROD_ID: SWCH-13065
T1 T2 = transistor:*-NPN_DRIVER-: NPN Bias Resistor Transistor
U1 = SparkFun-IC-Microcontroller:ATMEGA328P_TQFP: Popular 328P in QFP Storefront component: ATmega328 - TQFP <https://www.sparkfun.com/products/13448> (COM-13448) Datasheet <http://www.sparkfun.com/datasheets/Components/SMD/ATMega328.pdf> SparkFun Products SparkFun RedBoard - Programmed with Arduino <https://www.sparkfun.com/products/12757> (DEV-12757) Arduino Pro Mini 328 - 5V/16MHz <https://www.sparkfun.com/products/11113> (DEV-11113) Arduino Pro Mini 328 - 3.3V/8MHz <https://www.sparkfun.com/products/11114> (DEV-11114) SparkFun OpenLog <https://www.sparkfun.com/products/13712> (DEV-13712) SparkFun MicroView - OLED Arduino Module <https://www.sparkfun.com/products/12923> (DEV-12923) SparkFun Digital Sandbox <https://www.sparkfun.com/products/12651> (DEV-12651) SparkFun PicoBoard <https://www.sparkfun.com/products/11888> (WIG-11888) Arduino Fio <https://www.sparkfun.com/products/10116> (DEV-10116) LilyPad Arduino 328 Main Board <https://www.sparkfun.com/products/13342> (DEV-13342) SparkFun RedStick <https://www.sparkfun.com/products/13741> (DEV-13741) LilyPad MP3 <https://www.sparkfun.com/products/11013> (DEV-11013) LilyPad Arduino SimpleSnap <https://www.sparkfun.com/products/10941> (DEV-10941) SparkFun Stepoko <https://www.sparkfun.com/products/13899> (ROB-13899) SparkFun Geiger Counter <https://www.sparkfun.com/products/11345> (SEN-11345) SparkFun EL Sequencer <https://www.sparkfun.com/products/12781> (COM-12781) Arduino Pro 328 - 5V/16MHz <https://www.sparkfun.com/products/10915> (DEV-10915) CryptoCape <https://www.sparkfun.com/products/12773> (DEV-12773) SparkFun IR Thermometer Evaluation Board - MLX90614 <https://www.sparkfun.com/products/10740> (SEN-10740) SparkFun RedBot Mainboard <https://www.sparkfun.com/products/12097> (ROB-12097) Arduino Pro 328 - 3.3V/8MHz <https://www.sparkfun.com/products/10914> (DEV-10914) SparkFun Block for Intel® Edison - Arduino <https://www.sparkfun.com/products/13036> (DEV-13036) SparkFun Simon Says - Surface Mount Soldering Kit <https://www.sparkfun.com/products/10935> (KIT-10935) SparkFun 7-Segment Serial Display - Red <https://www.sparkfun.com/products/11441> (COM-11441) SparkFun 7-Segment Serial Display - White <https://www.sparkfun.com/products/11629> (COM-11629) SparkFun 7-Segment Serial Display - Yellow <https://www.sparkfun.com/products/11443> (COM-11443) SparkFun 7-Segment Serial Display - Kelly Green <https://www.sparkfun.com/products/11440> (COM-11440) SparkFun 7-Segment Serial Display - Blue <https://www.sparkfun.com/products/11442> (COM-11442) SparkFun OpenSegment Serial Display - 20mm (Blue) <https://www.sparkfun.com/products/11647> (COM-11647) SparkFun OpenSegment Serial Display - 20mm (Green) <https://www.sparkfun.com/products/11646> (COM-11646) SparkFun OpenSegment Serial Display - 20mm (White) <https://www.sparkfun.com/products/11648> (COM-11648) SparkFun OpenSegment Serial Display - 20mm (Red) <https://www.sparkfun.com/products/11644> (COM-11644) SparkFun OpenSegment Serial Display - 20mm (Yellow) <https://www.sparkfun.com/products/11645> (COM-11645) SparkFun OpenSegment Shield <https://www.sparkfun.com/products/13190> (DEV-13190); PROD_ID: IC-09069
U2 = SparkFun-RF:RFM69H: Hope RF RFM69H ISM Transceiver Module The RFM69H is a transceiver module capable of operation over a wide frequency range, including the 315,433,868 and 915MHz license-free ISM (Industry Scientific and Medical) frequency bands. All major RF communication parameters are programmable and most of them can be dynamically set. The RFM69H offers the unique advantage of programmable narrow-band and wide- band communication modes. The RFM69H is optimized for low power consumption while offering high RF output power and channelized operation.Compliance ETSI and FCC regulations. Datasheet <http://www.hoperf.cn/upload/docs/RF/SX/RFM69H_DataSheet_v1.3.pdf> SparkFun Products RFM69HCW Wireless Transceiver - 915MHz <https://www.sparkfun.com/products/13909> (COM-13909) RFM69HCW Wireless Transceiver - 434MHz <https://www.sparkfun.com/products/13910> (COM-13910) SparkFun RFM69 Breakout (915MHz) <https://www.sparkfun.com/products/12775> (WRL-12775) SparkFun RFM69 Breakout (434MHz) <https://www.sparkfun.com/products/12823> (WRL-12823)
U3 = AT24C256C-SSHL-T:AT24C256C-SSHL-T: EEPROM Serial-2Wire 256K-bit 32K x 8 1.8V/2.5V/3.3V/5V 8-Pin SOIC Bulk; DESCRIPTION: AT24C256C Series 256 Kb _32 K x 8_ 1.7 V I2C-Compatible Serial EEPROM - SOIC-8; DIGI-KEY_PART_NUMBER: AT24C256C-SSHL-TCT-ND; DIGI-KEY_PURCHASE_URL: https://www.digikey.com/product-detail/en/microchip-technology/AT24C256C-SSHL-T/AT24C256C-SSHL-TCT-ND/3178468?utm_source=snapeda&utm_medium=aggregator&utm_campaign=symbol; MF: Microchip; MP: AT24C256C-SSHL-T; PACKAGE: SO-8 Microchip
U4 = ADS1115IDGST:ADS1115IDGST: Analog-to-Digital Converter with Internal Reference; DESCRIPTION: 16-Bit ADC with Integrated MUX, PGA, Comparator, Oscillator, and Reference 10-VSSOP -40 to 125; DIGI-KEY_PART_NUMBER: 296-24934-1-ND; DIGI-KEY_PURCHASE_URL: https://www.digikey.com/product-detail/en/texas-instruments/ADS1115IDGST/296-24934-1-ND/2123298?utm_source=snapeda&utm_medium=aggregator&utm_campaign=symbol; MF: Texas Instruments; MP: ADS1115IDGST; PACKAGE: MSOP-10 Texas Instruments
U5 = DS1338Z-33_T_R:DS1338Z-33+T&R: I2C RTC with 56-Byte NV RAM; DESCRIPTION: Real Time Clock Serial 56Byte 8-Pin SOIC N T/R; DIGI-KEY_PART_NUMBER: DS1338Z-33+T&RCT-ND; DIGI-KEY_PURCHASE_URL: https://www.digikey.hu/product-detail/en/maxim-integrated/DS1338Z-33-T-R/DS1338Z-33-T-RCT-ND/3473112?WT.z_cid=ref_snapeda&utm_source=snapeda&utm_medium=aggregator&utm_campaign=buynow; MF: Maxim Integrated; MP: DS1338Z-33+T&amp;R; PACKAGE: SOIC-8 Maxim Integrated
U6 = SHT21:SHT21: Board Mount Humidity Sensors Humid & Temp Sensor; AVAILABILITY: Good; DESCRIPTION: SHT21 Series 3 V -40 to +125 °C Digital Humidity &amp; Temperature Sensor IC - DFN-6; MF: Sensirion; MP: SHT21; PACKAGE: DFN-6 Sensirion; PRICE: 4.83 USD
U$1 = MCP1603T-330I_OS:MCP1603T-330I/OS: 2.0 MHz, 500 mA Synchronous Buck Regulator; AVAILABILITY: Unavailable; DESCRIPTION: MCP1603 Series 2.8 MHz 500 mA Surface Mount Synchronous Buck Regulator - TSOT-5; MF: Microchip; MP: MCP1603T-330I/OS; PACKAGE: TSOT-23 Microchip; PRICE: None
U$2 U$3 = FloManEagle:COMF_BHC-18650-1P
U$4 = tft_1.8_1.44_oled_0.96:OLED_0.96_I2C
U$5 = MCP1252-33X50I_MS:MCP1252-33X50I/MS; AVAILABILITY: Unavailable; DESCRIPTION: Charge Pump Switching Regulator IC Positive Programmable 3.3V, 5V 1 Output 120mA 8-TSSOP, 8-MSOP _0.118, 3.00mm Width_; MF: Microchip; MP: MCP1252-33X50I/MS; PACKAGE: MSOP-8 Microchip; PRICE: None
U$8 = FloManEagle:BUZZER_5X9.6
X1 = adafruit:SMACONNECTOR: SMA Connector 90° DIP SMA Connector, 50 Ohm (4UConnector: 07259)
Y1 = SparkFun-Clocks:CRYSTAL-GROUNDED: Crystals w/ Ground Pin (Generic) These are passive quartz crystals, which can be used as a clock source for a microcontroller. Crystal's are usually two-terminal devices. A third terminal may be optionally connected to ground, as recommended by the manufaturer.
Y2 = SparkFun-Clocks:CRYSTAL-32.768KHZ: 32.768kHz Crystal Frequency: 32.768kHz Frequency Stability: ±20ppm Load Capacitance: 12.5pF (PTH-2X6 & SMD-3.2X1.5), 6pF (SMD-2X6) SparkFun Products: SparkFun BigTime Watch Kit <https://www.sparkfun.com/products/11734> SparkFun nRF52832 Breakout <https://www.sparkfun.com/products/13990> SparkFun Real Time Clock Module <https://www.sparkfun.com/products/12708>; PROD_ID: XTAL-13062

## Board
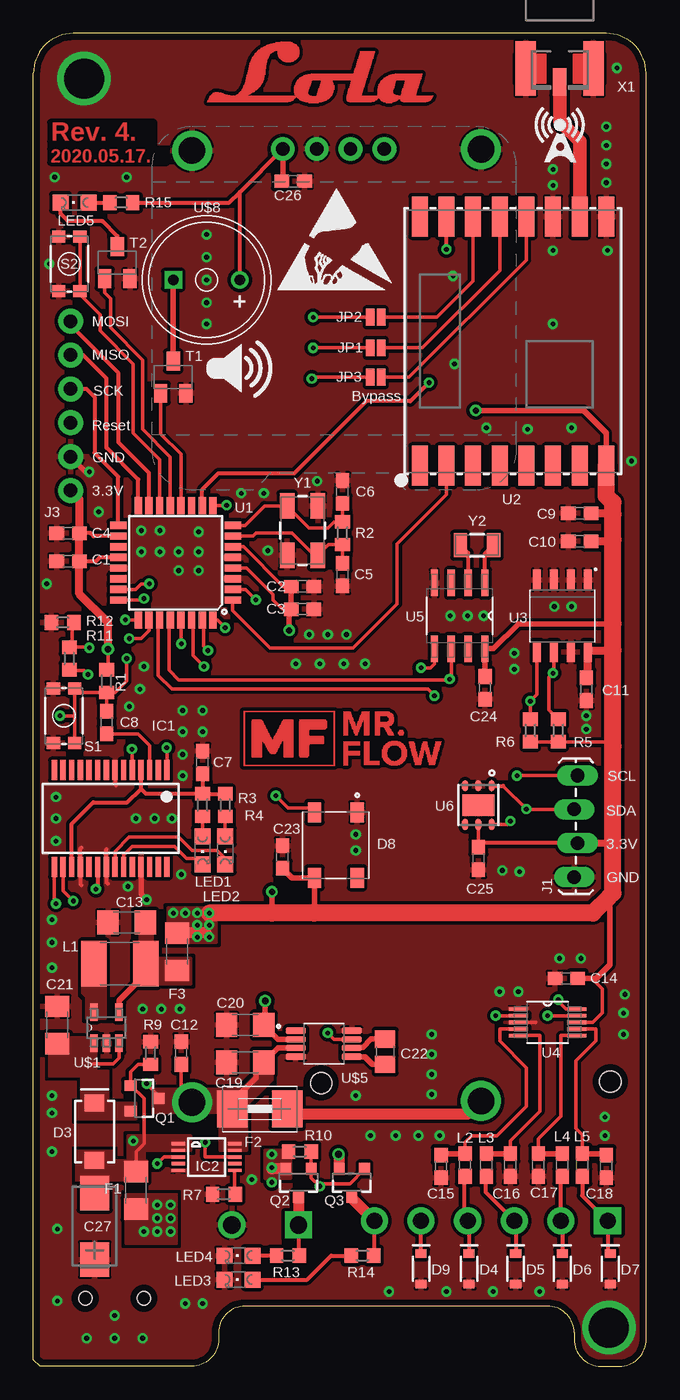
[diagram p4: board, top side]
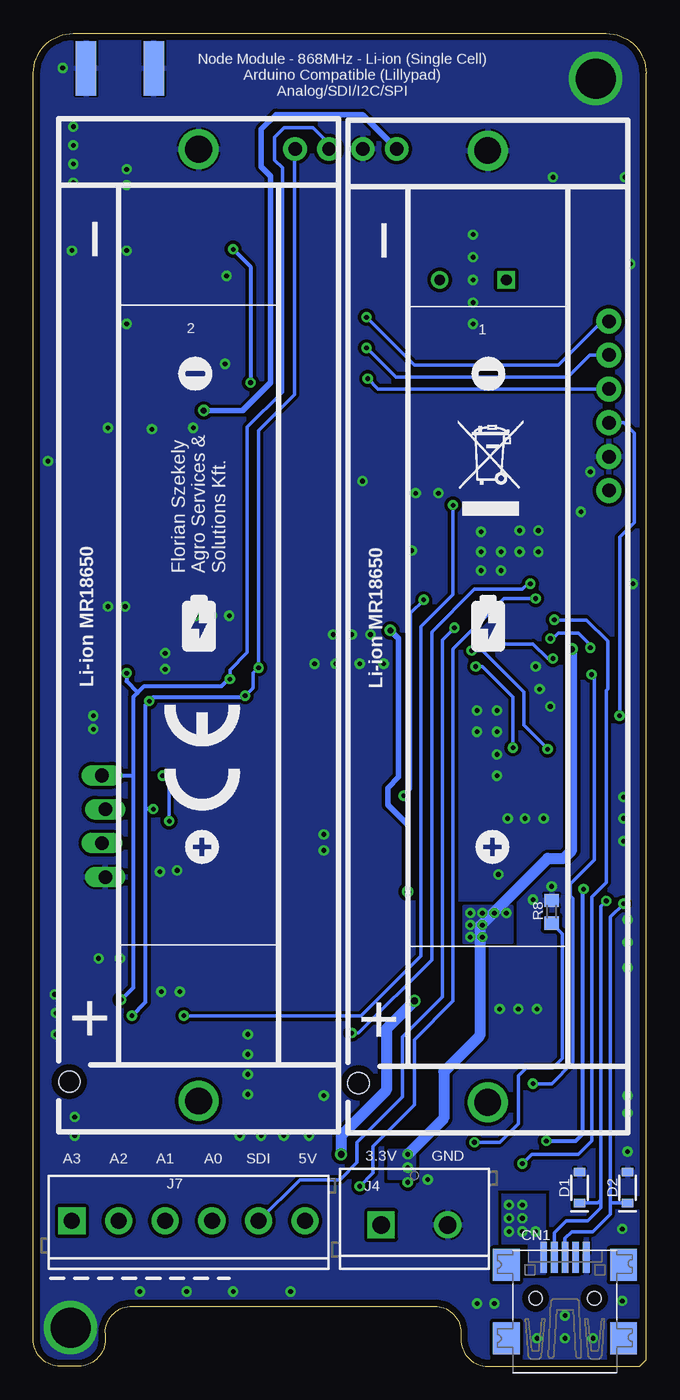
[diagram p5: board, bottom side, seen from below]

Size 46 x 100 mm. Coordinates in mm from the lower left corner, seen from the top.
Outline: 40.6,2.5 40.6,2 arc90 42.6,0 44,0 arc90 46,2 46,97 arc90 43,100 3,100 arc90 0,97 0,0.5 0.5,0 11.9,0 arc90 13.9,2 13.9,2.5 arc-90 15.9,4.5 38.6,4.5 arc-90 40.6,2.5
Copper layers (1*16): Top 0.035mm / dielectric 1.5mm / Bottom 0.035mm
Design rules "NYAKARUHAZ *": minimum track width 6mil, minimum drill 12mil, track to track 6mil, track to pad 6mil, pad to pad 6mil, via to via 6mil, smd to smd 6mil, copper to edge 20mil, drill to drill 8mil, minimum pad ring 10mil, minimum via ring 8mil, stop-mask expansion 4mil, vias tented up to drill 0.6mm, thermal gap 6mil

### Footprints (pad centres in the part's own frame; a part is rotated, then mirrored left to right if it is on the bottom)
C0603 = smd 1.1 x 1: 1 -0.85,0; 2 0.85,0
C1206 = smd 1.6 x 1.8: 1 -1.4,0; 2 1.4,0
C0805 = smd 1.3 x 1.5: 1 -0.95,0; 2 0.95,0
CT6032 = smd 2.6 x 2.2: + -2.5,0; - 2.5,0
USB-MINIB = smd 0.5 x 2.308: D+ 0,4.064; D- -0.8,4.064; GND 1.6,4.064; ID 0.8,4.064; VBUS -1.6,4.064 | smd 2 x 2.4: GND1 -4.4,-2; GND2 -4.4,3.5; GND3 4.4,3.5; GND4 4.4,-2 | hole 1: -2.2,1; 2.2,1
SOD-323 = smd 0.63 x 0.83: A 1.15,0; C -1.15,0
SMA-DIODE = smd 1.27 x 1.47: A -2.15,0; C 2.15,0
LED_1655 = smd 1.5 x 1: 1 -2.45,1.6; 2 -2.45,-1.6; 3 2.45,-1.6; 4 2.45,1.6
1206 = smd 1.6 x 1.8: 1 -1.4,0; 2 1.4,0
1812 = smd 2.286 x 2.794: 1 -2.046,0; 2 2.046,0
SSOP28 = smd 0.4 x 1.5: 1 -4.225,-3.625; 2 -3.575,-3.625; 3 -2.925,-3.625; 4 -2.275,-3.625; 5 -1.625,-3.625; 6 -0.975,-3.625; 7 -0.325,-3.625; 8 0.325,-3.625; 9 0.975,-3.625; 10 1.625,-3.625; 11 2.275,-3.625; 12 2.925,-3.625; 13 3.575,-3.625; 14 4.225,-3.625; 15 4.225,3.625; 16 3.575,3.625; 17 2.925,3.625; 18 2.275,3.625; 19 1.625,3.625; 20 0.975,3.625; 21 0.325,3.625; 22 -0.325,3.625; 23 -0.975,3.625; 24 -1.625,3.625; 25 -2.275,3.625; 26 -2.925,3.625; 27 -3.575,3.625; 28 -4.225,3.625
MSOP10 = smd 0.25 x 1: 1 -1,-2.113; 2 -0.5,-2.113; 3 0,-2.113; 4 0.5,-2.113; 5 1,-2.113; 6 1,2.113; 7 0.5,2.113; 8 0,2.113; 9 -0.5,2.113; 10 -1,2.113
1X04_LOCK_LONGPADS = drill 1.016 long: 1 0,0; 2 2.54,-0.254; 3 5.08,0; 4 7.62,-0.254
1X06_NO_SILK = drill 1.016 pad 1.88: 1 0,0; 2 2.54,0; 3 5.08,0; 4 7.62,0; 5 10.16,0; 6 12.7,0
SCREWTERMINAL-5MM-2 = drill 1.3 pad 2.032 square: 1 0,0 | drill 1.3 pad 2.032: 2 5,0
SCREWTERMINAL-3.5MM-6 = drill 1.2 pad 2.032 square: 1 0,0 | drill 1.2 pad 2.032: 2 3.5,0; 3 7,0; 4 10.5,0; 5 14,0; 6 17.5,0
SMT-JUMPER_2_NO_NO-SILK = smd 0.635 x 1.27: 1 -0.406,0; 2 0.406,0
L1812 = smd 1.9 x 3.4: 1 -1.95,0; 2 1.95,0
0603 = smd 1.1 x 1: 1 -0.85,0; 2 0.85,0
CHIPLED_0805 = smd 1.2 x 1.2: A 0,-1.05; C 0,1.05
SOT23-3 = smd 0.8 x 0.9: 1 -0.95,-1; 2 0.95,-1; 3 0,1.1
R0603 = smd 1 x 1.1: 1 -0.85,0; 2 0.85,0
TACTILE_SWITCH_SMD_4.6X2.8MM = smd 0.9 x 1: 1 -2.05,-0.8; 2 2.05,-0.8; 3 2.05,0.8; 4 -2.05,0.8
SC59-BEC = smd 1 x 1.4: B -0.95,-1.2; C 0,1.2; E 0.95,-1.2
TQFP32-08 = smd 1.27 x 0.559: 1 -4.293,2.8; 2 -4.293,2; 3 -4.293,1.2; 4 -4.293,0.4; 5 -4.293,-0.4; 6 -4.293,-1.2; 7 -4.293,-2; 8 -4.293,-2.8; 17 4.293,-2.8; 18 4.293,-2; 19 4.293,-1.2; 20 4.293,-0.4; 21 4.293,0.4; 22 4.293,1.2; 23 4.293,2; 24 4.293,2.8 | smd 0.559 x 1.27: 9 -2.8,-4.293; 10 -2,-4.293; 11 -1.2,-4.293; 12 -0.4,-4.293; 13 0.4,-4.293; 14 1.2,-4.293; 15 2,-4.293; 16 2.8,-4.293; 25 2.8,4.293; 26 2,4.293; 27 1.2,4.293; 28 0.4,4.293; 29 -0.4,4.293; 30 -1.2,4.293; 31 -2,4.293; 32 -2.8,4.293
RFM69W-XXXS2 = smd 3 x 1.2: 1 -9.35,7; 2 -9.35,5; 3 -9.35,3; 4 -9.35,1; 5 -9.35,-1; 6 -9.35,-3; 7 -9.35,-5; 8 -9.35,-7; 9 9.35,-7; 10 9.35,-5; 11 9.35,-3; 12 9.35,-1; 13 9.35,1; 14 9.35,3; 15 9.35,5; 16 9.35,7
SOIC127P600X175-8N = smd 1.55 x 0.6: 1 -2.7,1.905; 2 -2.7,0.635; 3 -2.7,-0.635; 4 -2.7,-1.905; 5 2.7,-1.905; 6 2.7,-0.635; 7 2.7,0.635; 8 2.7,1.905
SOP50P490X110-10N = smd 1.422 x 0.279: 1 -2.184,0.991; 2 -2.184,0.508; 3 -2.184,0; 4 -2.184,-0.508; 5 -2.184,-0.991; 6 2.184,-0.991; 7 2.184,-0.508; 8 2.184,0; 9 2.184,0.508; 10 2.184,0.991
SOIC127P600X175-8N' = smd 1.981 x 0.533: 1 -2.464,1.905; 2 -2.464,0.635; 3 -2.464,-0.635; 4 -2.464,-1.905; 5 2.464,-1.905; 6 2.464,-0.635; 7 2.464,0.635; 8 2.464,1.905
SON100P300X300X110-7N = smd 0.85 x 0.45: 1 -1.45,1; 2 -1.45,0; 3 -1.45,-1; 4 1.45,-1; 5 1.45,0; 6 1.45,1 | smd 1.6 x 2.4: 7 0,0
SOT95P280X110-5N = smd 1.321 x 0.559: 1 -1.168,0.94; 2 -1.168,0; 3 -1.168,-0.94; 4 1.168,-0.94; 5 1.168,0.94
MR18650_HOLDER = drill 2 pad 3: P$1 35.7,0; P$2 -35.7,0 | hole 1.6: 34.25,-9.7
OLED_0.96_I2C = drill 1 pad 1.778: GND -1.63,11.63; SCL 0.91,11.63; SDA 3.45,11.63; VCC -4.17,11.63
SOP65P490X110-8N = smd 1.5 x 0.49: 1 -2.105,0.975; 2 -2.105,0.325; 3 -2.105,-0.325; 4 -2.105,-0.975; 5 2.105,-0.975; 6 2.105,-0.325; 7 2.105,0.325; 8 2.105,0.975
BUZZER_5X9.6 = drill 0.8: + -2.5,0 | drill 0.8 square: - 2.5,0
SMA_EDGELAUNCH_UFL = smd 4.064 x 1.524: GND@1 2.032,-2.54; GND@2 2.032,2.54 | smd 4.064 x 1.524 bottom: GND@3 2.032,2.54; GND@4 2.032,-2.54 | smd 2.032 x 1.016: P 3.048,0
CRYSTAL-SMD-5X3.2-4PAD = smd 1.9 x 1.1: 1 -1.85,-1.15; 2 1.85,-1.15; 3 1.85,1.15; 4 -1.85,1.15
CRYSTAL-SMD-3.2X1.5MM = smd 1 x 1.8: P$1 -1.25,0; P$2 1.25,0

### Placement (x,y rotation side)
C1  2.6,60.4 180 top
C2  20.2,58.5 0 top
C3  20.2,56.8 0 top
C4  2.6,62.5 180 top
C5  23.2,59.4 270 top
C6  23.2,65.6 90 top
C7  12.7,45.3 90 top
C8  5.5,48.3 270 top
C9  41,64 180 top
C10  41,61.9 180 top
C11  41.5,50.8 270 top
C12  11.1,23.5 90 top
C13  7,33.3 180 top
C14  40,29.1 180 top
C15  30.6,15 90 top
C16  35.8,15.1 90 top
C17  37.9,15.1 90 top
C18  43,15 90 top
C19  15.9,22.8 180 top
C20  15.9,25.6 180 top
C21  1.8,25.6 270 top
C22  26.4,23.6 270 top
C23  18.7,38.2 90 top
C24  33.9,50.9 90 top
C25  33.4,38.1 270 top
C26  19.5,88.9 180 top
C27  4.6,10.5 90 top
CN1  6.1,4.1 0 bottom
D1  5,13.4 90 bottom
D2  1.4,13.4 90 bottom
D3  4.6,17.6 90 top
D4  32.7,7.3 270 top
D5  36.2,7.3 270 top
D6  39.7,7.3 270 top
D7  43.3,7.3 270 top
D8  22.7,39.1 270 top
D9  29.1,7.3 270 top
F1  7.7,13.2 90 top
F2  17,19.3 180 top
F3  10.8,31.1 90 top
IC1  5.8,41.1 180 top
IC2  13,15.7 270 top
J1  40.6,36.7 90 top
J3  2.8,65.7 90 top
J4  19.9,10.6 0 bottom
J7  43.1,10.9 0 bottom
JP1  25.7,76.4 180 top
JP2  25.7,78.7 180 top
JP3  25.7,74.2 180 top
L1  6.5,30.2 180 top
L2  32.4,15.1 90 top
L3  34,15.1 90 top
L4  39.7,15.1 90 top
L5  41.2,15.1 90 top
LED1  12.7,38.7 180 top
LED2  14.4,38.7 180 top
LED3  15.4,6.5 90 top
LED4  15.4,8.3 90 top
LED5  3.1,87.3 90 top
Q1  8.3,20.1 270 top
Q2  19.9,13.8 180 top
Q3  23.9,13.8 180 top
R1  5.5,51.4 270 top
R2  23.2,62.5 270 top
R3  12.7,42.1 90 top
R4  14.4,42.1 90 top
R5  39.4,47.7 270 top
R6  37.3,47.7 270 top
R7  14.3,12.9 180 top
R8  7.1,34.1 90 bottom
R9  8.8,23.5 270 top
R10  20,16.1 180 top
R11  2.7,53.1 270 top
R12  2.2,55.8 0 top
R13  19.1,8.3 180 top
R14  24.7,8.3 180 top
R15  6.6,87.3 0 top
S1  2.3,48.8 90 top
S2  2.7,82.7 90 top
T1  10.5,74.2 0 top
T2  6.3,82.8 0 top
U1  10.68,60.28 180 top
U2  36,76.9 90 top
U3  39.7,56.3 270 top
U4  38.6,25.8 0 top
U5  DS1338Z-33+T&R  [SOIC127P600X175-8N']  32,56.3 270 top
U6  33.4,42.1 270 top
U$1  5.5,25.4 90 top
U$2  33.6,55.6 270 bottom
U$3  11.9,55.5 270 bottom
U$4  22.9,79.7 0 top
U$5  21.8,24.2 0 top
U$6  [LOLA_LOGO_LAYER]  12.8,94.3 0 top
U$7  [MRFLOW]  14.3,44.5 0 top
U$8  13,81.5 180 top
U$9  [RADIO_LOGO]  36.8,89.7 0 top
U$10  [MINUS_LOGO]  35.1,73.2 0 bottom
U$11  [ESD_LOGO]  18,80.1 0 top
U$12  [TONNE_LOGO]  14.2,63.8 0 bottom
U$13  [AGRO_SMALL_LOGO]  19.9,27.6 0 top
U$14  [SOUND_ICON]  12.9,72.6 0 top
U$15  [MINUS_LOGO]  13.1,73.2 0 bottom
U$16  [PLUS_LOGO]  12.8,37.7 0 bottom
U$17  [PLUS_LOGO]  34.6,37.7 0 bottom
U$18  [BATTERY_LOGO]  35,53.5 0 bottom
U$19  [BATTERY_LOGO]  13.3,53.5 0 bottom
U$20  [CE_LOGO]  30.5,41.7 90 bottom
X1  39.5,99.4 270 top
Y1  20.2,62.7 270 top
Y2  33.3,61.6 0 top

### Tracks (layer width: path | path; a pad name or v marks a point on that pad's centre or on a via)
3.3V  (via drill 0.35, 0.45, 0.5)
  Top 0.254: C14.1 41.9,29.1 42.7,28.3 42.7,26.5 42,25.8 U4.8 | C2.1 18.75,58.5 15.77,61.48 U1.6 | C3.1 19.2,56.8 18.7,56.8 18,57.5 18,57.9 16,59.9 14.99,59.9 U1.4 | v5.6,53.8 5.6,52.35 R1.1 | 43.5,46.5 43.15,46.85 R5.2 R6.2 | 33.4,39.3 U6.5
  Top 0.305: C1.1 4.7,60.4 5,60.7 6.37,60.7 U1.20 | U1.18 4.52,62.28 4.3,62.5 C4.1 | J1.2 33.46,39.24 | 33.46,39.24 33.4,39.3 | 33.46,39.24 33.4,39.18 C25.1 | U$8.+ 15.5,88.1 | 15.5,88.1 U$4.VCC | R15.2 14.7,87.3 15.5,88.1
  Top 0.406: 43.25,35.25 43.25,30.1 42.25,29.1 C14.1 | C24.2 U5.8 34.54,53.84 36.4,55.7 43.5,55.7 | U2.8 43,70 41.3,71.7 v33.2,71.7 | U$4.VCC 18.73,88.98 C26.2 | 17.9,34 v17.9,35.6 | v19.2,55.2 19.2,56.8 | C3.1 C2.1 | 21.1,34 D8.3 19.4,36.65 C23.1
  Top 0.508: J1.2 43.44,39.24 43.5,39.3
  Top 0.61: v5.6,53.8 5.6,55.8 3.45,57.95 C1.1 C4.1 3.45,65.05 J3.1 | C9.1 43.4,64 43.5,63.9 | C10.1 43.4,61.9 43.5,62 | 43.5,53.7 41.7,53.7 U3.8 41.6,52.05 41.5,52.04 C11.1
  Top 0.813: Q2.2 17.9,14.8 | 13,32.5 F3.2
  Top 1.016: 43.25,35.25 43.5,35.5
  Top 1.27: v13.2,34 17.9,34 21.1,34 42,34 43.25,35.25 | 43.5,35.5 43.5,39.3 43.5,46.5 43.5,53.7 43.5,55.7 43.5,62 43.5,63.9 43.5,64.8 43,65.3 U2.8
  Bottom 0.406: v33.2,71.7 30.3,71.7 28.2,73.8 28.2,89.3 28.9,90 28.9,92.8 27.8,93.9 21.3,93.9 U$4.VCC | v19.2,55.2 18.6,54.6 18.6,44.2 19.4,43.4 19.4,42.1 17.9,40.6 v17.9,35.6
  Bottom 0.813: v5.6,53.8 5.6,38.7 6.2,38.1 7.4,38.1 12.5,33 12.5,24.8 15.2,22.1 15.2,18.6 v17.9,15.9
  other vias: 13.2,33.1 12.3,34 11.4,34 10.5,34 12.3,33.1 12.3,32.2 13.2,32.2 17.9,14.9 17.9,13.8
  pour Top (no thermals): 17.4,14.1 19.3,14.1 19.3,16.2 17.4,16.2
  pour Top (no thermals): 10.1,31.8 10.1,34.4 13.7,34.4 13.7,31.8
  pour Bottom (no thermals): 10.1,34.5 10.1,31.8 13.7,31.8 13.7,34.5
  pour Bottom (no thermals): 17.4,16.2 19.3,16.2 19.3,14.1 17.4,14.1
5V  (via drill 0.35)
  Top 0.254: R9.2 7.85,22.65 7.3,22.1 Q1.1 7.35,21.05 8.3,20.1 8.3,16.7 7.7,16.1 F1.2
  Top 0.305: IC1.20 4.83,35.92 v4.7,35.8
  Bottom 0.305: v4.7,35.8 4.8,35.7 4.8,17.4 5.3,16.9 v7.5,16.9
  pour Top (no thermals): 8.5,13.9 3.2,13.9 3.2,16.2 6,16.2 6,15.5 8.5,15.5
  pour Top (no thermals): 11.8,16.2 8.3,16.2 8.3,14.6 7.1,14.6 7.1,17.3 11.8,17.3
5V_OUT
  Top 0.305: R14.1 25.6,8.35 J7.6
  Top 0.813: J7.6 23.9,12.6 Q3.3
!EXT_RESET
  Top 0.254: 8.7,44.75 IC1.3 8.72,46.58 7.85,47.45 C8.2
!RESET  (via drill 0.35)
  Top 0.254: S1.1 3.1,48.8 | 3.1,48.8 S1.2 3.4,50.55 R1.2 | R1.2 6.15,50.55 7,51.4 v7,53.1 | R1.2 C8.1 | U1.29 11.08,54.22 v11.1,54.2 | 3.1,48.8 v2,48.8
  Bottom 0.254: v7,53.1 7.4,53.1 8.5,54.2 v11.1,54.2 | v2,48.8 2,62.2 0.9,63.3 0.9,70 1.68,70.78 J3.3
A0
  Top 0.305: D4.C 32.7,10.8 J7.4 32.35,11.15 32.35,14.2
  Top 0.406: 32.35,14.2 L2.1
A1
  Top 0.305: D5.C 36.2,10.8 J7.3 33.95,13.05 33.95,14.2
  Top 0.406: 33.95,14.2 L3.1
A2
  Top 0.305: D6.C 39.7,10.8 J7.2 39.6,14.15 L4.1
  Top 0.406: 39.65,14.2 L4.1
A3
  Top 0.305: D7.C 43.1,8.65 J7.1 41.2,12.8 L5.1
  Top 0.406: 41.25,14.2 L5.1
ADC_RDY  (via drill 0.35)
  Top 0.254: U4.2 36.41,26.3 v34.7,26.3 | v14.5,64.6 14.47,64.57 U1.9
  Bottom 0.254: v34.7,26.3 21.4,26.3 16.9,30.8 16.9,55.5 14.5,57.9 v14.5,64.6
AIN0
  Top 0.254: L2.2 32.4,16.8 32.9,17.3 34.8,17.3 37,19.5 37,22.4 35,24.4 35,25.3 36.41,25.3 U4.4
  Top 0.406: C15.2 30.7,15.95 L2.2
AIN1
  Top 0.254: C16.2 35.8,16.9 38.02,19.12 38.02,24.81 U4.5
  Top 0.406: C16.2 L3.2
AIN2
  Top 0.254: C17.2 37.9,17.05 39.6,18.75 39.6,24.81 U4.6
  Top 0.406: L4.2 C17.2
AIN3
  Top 0.254: L5.2 41.2,17.35 40.7,17.85 40.7,22.9 42.2,24.4 42.2,25.3 40.79,25.3 U4.7
  Top 0.406: L5.2 42.9,15.95 C18.2
BATT_SENSE  (via drill 0.35)
  Top 0.254: U1.26 8.68,55.18 8.1,54.6 v7.2,54.6 | v4.2,53.9 4.15,53.95 R11.1 2.7,54.3 2.9,54.5 2.9,55.65 R12.2
  Bottom 0.254: v4.2,53.9 4.2,54.1 5.1,55 6.6,55 7,54.6 v7.2,54.6
BUCK_EN  (via drill 0.35)
  Top 0.254: U$5.7 22.57,24.52 v22.1,25 | v8.7,58.7 8.1,58.7 7.68,58.28 U1.23
  Bottom 0.254: v22.1,25 21.6,25 16.1,30.5 16.1,55.1 12.9,58.3 9.3,58.3 8.9,58.7 v8.7,58.7
BUZZER
  Top 0.254: T1.B 9.55,69.95 11.08,68.42 U1.12
CHG  (via drill 0.35)
  Top 0.254: IC2.3 9.8,15.7 v9.3,15.2 | U1.25 7.87,56 v6.9,56
  Bottom 0.254: v9.3,15.2 8.6,15.9 5.1,15.9 4.1,16.9 4.1,35.2 3,36.3 3,50.7 2.9,50.8 2.9,54.4 4.5,56 v6.9,56
FT_3.3V
  Top 0.305: C7.1 R3.2 | R3.2 R4.2 | R3.2 8.45,42.95 8.07,43.33 | 8.07,43.33 IC1.4 | IC1.17 2.88,40.67 4.5,42.3 7.05,42.3 8.07,43.33
GND  (via drill 0.35, 3)
  Top 0.254: U4.3 37.7,25.8
  Top 0.305: IC1.7 6.12,43.67 6.2,43.6 | 5.5,38.8 5.47,38.77 IC1.21 5.47,36.33 5.6,36.2 | 3.6,38.9 3.52,38.83 IC1.18 3.52,36.17 3.6,36.1
  Top 0.406: IC1.25 8.07,35.42 v8.5,35 | J3.2 3.94,67.1 v4.2,67.1
  other vias: 11.4,4.7 12.7,4.7 1.8,10.3 1.8,4.9 6.1,2.1 1.4,20.3 1.4,16.1 1.4,19 16.4,14 11,26.8 9.6,26.8 8.2,26.8 1.4,29.9 1.4,31.8 1.4,33.5 7.1,36 1.7,39.4 1.7,41.1 1.7,42.7 11.2,44.3 11.2,45.9 12.7,47.6 11.2,47.6 12.7,49.2 11.2,49.2 8.3,52.5 7.2,49.5 8,50.8 4.9,64.1 8.1,62.7 12.4,59.7 10.9,59.7 8.1,61.1 9.5,61.1 10.9,61.1 12.4,61.1 12.4,62.6 17.6,61.2 15.6,65.5 17.3,65.5 21.3,66.4 20.7,54.9 22.1,54.9 23.5,54.9 33.8,56.3 32.6,56.3 31.3,56.3 40.4,57 39.1,57 40.4,70.4 37.1,70.3 34,70.4 39,88.6 39,83.7 43.1,83.7 43,88.8 43,90.2 43,91.6 43,93 1.2,82.7 9.5,62.7 1.6,89.2 7,89.2 19.7,52.7 21.5,52.7 23.3,52.7 24.9,52.7 26.7,5.6 31,5.6 34.5,5.6 38,5.6 43.2,2.9 3.8,96.6 36.4,28.1 35,28.1 44.4,27.9 44.3,26.5 44.3,24.9 35.2,37.2 36.5,37.1 41.5,48.8 41.5,47.8 36.1,53.5 36.1,52.3 24.2,39.9 24.2,38.7 24.2,20.3 29.9,20.4 29.9,21.9 29.9,23.4 29.9,24.9 10.4,41.1 9.1,41.1 7.7,41.1 11.1,36.9 30.5,17.3 28.9,17.3 27.2,17.3 42.9,17.3 42.9,18.7 4,2.1 8.2,2.1 6.1,3.8 39.5,30.6 41.1,30.6 25.3,17.3 39,89.8 43.8,97.4 13,81.5 13,84.9 39,78.2 31.5,81.8 31.6,75.2 44.9,67.9 1,58.7 13,83.2 13,79.8 13,78.2
  pour Top (isolate 0.254, rank 6): -6,116.2 51.7,116.2 51.7,-8.1 -6,-8.1
  pour Bottom (isolate 0.254, rank 6): -3.2,113.1 48.8,113.1 48.8,-2.2 -3.2,-2.2
LED
  Top 0.254: U1.13 10.28,68.22 8.2,70.3 8.2,75.5 5.8,77.9 5.8,80.1 5.35,80.55 T2.B
MISO  (via drill 0.35)
  Top 0.254: v21,76.4 JP1.2
  Top 0.305: U1.16 7.88,66.52 5.5,68.9 5.5,74.1 3.74,75.86 J3.5
  Bottom 0.254: J3.5 4.24,75.86 5.9,74.2 18.8,74.2 v21,76.4
MOSI  (via drill 0.35)
  Top 0.254: v21,78.7 JP2.2
  Top 0.305: U1.15 8.68,67.02 6.4,69.3 6.4,74.5 2.8,78.1 J3.6
  Bottom 0.254: J3.6 3.3,78.4 6.6,75.1 17.4,75.1 v21,78.7
N$1
  Top 1.016: U2.10 41,91.9 39.5,93.4 X1.P
N$2
  Top 0.813: U$2.P$1 32.6,18.9 19.45,18.9 F2.1
N$3
  Top 0.406: U$1.4 6.44,27.44 8.1,29.1
  pour Top (no thermals): 11.8,30.6 8.9,30.6 8.9,33.9 8,33.9 8,28.7 11.8,28.7
N$4
  Top 0.305: LED5.A R15.1
N$5
  Top 0.305: LED3.A 20.55,6.5 22.35,8.3 R14.2
N$6
  Top 0.305: U5.1 33.91,60.95 Y2.P$2
N$7
  Top 0.305: Y2.P$1 32.63,61.02 U5.2
N$8
  Top 0.305: R13.2 LED4.A
N$9
  Top 0.305: T2.C 6.3,84.8 5.2,85.9 2.6,85.9 2.05,86.45 LED5.C
N$11
  Top 0.406: U$8.- T1.C
N$17
  Top 0.254: U1.7 16.48,62.28 16.7,62.5 19.4,62.5 21.05,60.85 Y1.3 22.15,61.65 R2.2 C5.1
N$18
  Top 0.254: U1.8 15.88,63.08 17.35,64.55 Y1.1 20.7,62.9 22.1,62.9 22.55,63.35 R2.1 C6.1
N$19  (via drill 0.35)
  Top 0.254: IC2.8 12.9,15.7 v12.9,16.8
  Bottom 0.254: v12.9,16.8 11,16.8 9.6,18.2 9.6,21.8 9,22.4 7,22.4 6.3,23.1 6.3,32.45 R8.1
N$20  (via drill 0.35)
  other vias: 9.3,12.1 10.3,12.1 10.3,11.1 10.3,10.1 9.3,11.1 9.3,10.1 8.3,10.1
  pour Top (no thermals): 6.9,12.9 6.9,9.2 10.8,9.2 10.8,12.9
  pour Bottom (no thermals): 7.6,6.9 8.8,6.9 8.8,9.2 10.8,9.2 10.8,12.9 7.6,12.9
N$21  (via drill 0.35)
  Top 0.254: v1.7,34.7 1.57,34.83 IC1.15
  Bottom 0.254: CN1.D+ 6.1,9.6 5.6,10.1 4,10.1 2.7,11.4 2.7,12.3 | v1.7,34.7 2.7,33.7 2.7,12.3 | D2.C 2.65,12.25 2.7,12.3
N$22  (via drill 0.35)
  Top 0.254: v3,34.9 2.23,35.67 IC1.16
  Bottom 0.254: CN1.D- 6.9,10 6,10.9 4.4,10.9 3.4,11.9 3.4,12.5 | v3,34.9 3.4,34.5 3.4,12.5 | D1.C 3.65,12.25 3.4,12.5
N$23
  Top 0.254: R4.1 LED2.A
N$24
  Top 0.254: LED2.C 14.4,38.1 13.8,38.7 11.9,38.7 10.9,39.7 7.2,39.7 6.12,38.62 IC1.22
N$25
  Top 0.254: LED1.C 12.25,38.1 11.5,38.1 10.6,39 7.4,39 6.78,38.38 IC1.23
N$26
  Top 0.254: R3.1 LED1.A
N$28
  Top 0.254: IC2.6 15.11,12.9 R7.1
N$29
  pour Top (no thermals): 5.4,26.1 5.4,28.7 3.7,28.7 3.7,28 4,27.7 4,26.1
N$30  (via drill 0.5)
  Top 0.406: U$5.2 18.38,24.52 C20.1 17.4,25.7 v17.4,27.4 | v22.9,15.9 22.95,15.85
  Top 0.813: 22.95,15.85 Q3.2
  Bottom 0.813: v17.4,27.4 19.5,25.3 19.5,20.7 22.9,17.3 v22.9,15.9
N$31
  Top 0.406: U$5.6 23.95,23.92 24.73,23.92 25.36,24.55 C22.1
N$32
  Top 0.406: U$5.5 24.88,23.23 25.45,22.65 C22.2
NEO_LED  (via drill 0.35)
  Top 0.254: D8.2 21.1,41.9 19.1,41.9 v18.2,42.8 | v16.7,57.5 15.92,58.28 U1.2
  Bottom 0.254: v18.2,42.8 17.7,43.3 17.7,56.5 v16.7,57.5
OUT_EN  (via drill 0.35)
  Top 0.254: U1.24 8.18,57.48 v8.3,57.6 | Q3.1 23.75,13.7 21.7,13.7 v21.5,13.5 20.85,14.15 Q2.1 R10.1
  Bottom 0.254: v8.3,57.6 10.7,57.6 14.5,53.8 14.5,27.4 17.4,24.5 17.4,19.6 20.49,16.51 20.49,14.51 v21.5,13.5
PW_OUT
  Top 0.305: R13.1 19.95,10.6 J4.1
  Top 0.813: Q2.3 J4.1
RF_INT
  Top 0.254: U2.2 31,65.4 27.3,61.7 27.3,57.2 24,53.9 17.75,53.9 14.97,56.68 U1.1
RF_SS  (via drill 0.35)
  Top 0.305: U1.10 12.68,65.78 13.9,67 19.6,67 25,72.4 28.3,72.4 v29.7,73.8 | v31,83.8 U2.15
  Bottom 0.305: v29.7,73.8 29.7,82.5 v31,83.8
RMISO
  Top 0.254: JP1.1 29.2,76.4 35,82.2 U2.13
RMOSI
  Top 0.254: JP2.1 30.3,78.7 33,81.4 U2.14
RSCK
  Top 0.254: JP3.1 28.2,74.2 37,83 U2.12
RX  (via drill 0.35)
  Top 0.254: U1.30 11.98,55.89 11.98,53.32 v12.8,52.5 | v10,46.4 10.03,46.38 IC1.1
  Bottom 0.254: v12.8,52.5 12.3,52.5 10,50.2 v10,46.4
SCK  (via drill 0.35)
  Top 0.254: v20.9,74.1 21,74.2 JP3.2
  Top 0.305: U1.17 6.39,66.73 4.6,68.52 4.6,72.72 4,73.32 J3.4
  Bottom 0.254: J3.4 20.12,73.32 v20.9,74.1
SCL  (via drill 0.35)
  Top 0.254: 31.2,51.5 10.9,51.5 10.18,52.22 10.18,55.89 U1.28 | 31.36,51.66 U5.6 | U4.10 39.98,26.79 39.4,27.38 v39.4,27.5 | U3.6 39.06,52.06 v39,52 38.7,51.7 38.7,49.25 R5.1 | U6.6 35.55,40.65 | 36.32,44.32 J1.4
  Top 0.305: 31.2,51.5 v31.25,51.55 31.36,51.66 | 35.55,40.65 v35.8,40.9 | v36.3,44.3 36.32,44.32
  Bottom 0.254: 38.2,50.6 38.2,50.5 | 31.35,51.55 v31.25,51.55 31.25,52.25 29.95,53.55 29.95,70.45 27.3,73.1 27.3,89.9 27.9,90.5 27.9,92.2 27.18,92.92 25,92.92 23.81,91.73 U$4.SCL | 38.52,44.32 38.5,44.3 | v35.8,40.9 35.8,43.8 v36.3,44.3
  Bottom 0.305: v39.4,27.5 38.5,28.4 38.5,44.3 38.5,50.2 38.2,50.5 37.68,51.02 31.88,51.02 31.35,51.55 | v39,52 39,51.4 38.2,50.6 | J1.4 38.52,44.32
SDA  (via drill 0.35)
  Top 0.254: 9.5,55.97 U1.27 9.38,55.89 9.38,51.82 10.4,50.8 29.6,50.8 v30.1,50.3 | 37.45,48.55 R6.1 v37.3,49.9 37.8,50.4 U3.5 | U5.5 30.09,52.7 29.8,52.4 v29.1,52.4 | v38.6,26.3 U4.9 | J1.3 37.02,41.78 v37,41.8 35.25,43.55
  Top 0.305: U6.1 35.25,43.55
  Bottom 0.254: v30.1,50.3 29.5,50.9 29.5,52 v29.1,52.4 29.1,70.2 26.4,72.9 26.4,91.28 U$4.SDA | v37.3,49.9 37.6,49.6
  Bottom 0.305: v30.1,50.3 30.2,50.2 37,50.2 v37.3,49.9 | 37.6,49.6 37.6,41.8 | 37.6,41.8 37.6,27.3 v38.6,26.3 | v37,41.8 37.6,41.8
SDI  (via drill 0.35)
  Top 0.254: v14.4,55.4 13.81,55.99 U1.32
  Top 0.305: D9.C J7.5
  Bottom 0.254: v14.4,55.4 15.3,54.5 15.3,27.7 18.3,24.7 18.3,20.2 21.7,16.8 21.7,15.3 23,14 26,14 J7.5
SW
  Top 0.254: U1.14 9.48,68.02 7.5,70 7.5,75.2 5,77.7 5,78.9 3.5,80.4 S2.1 S2.2
TX  (via drill 0.35)
  Top 0.254: IC1.5 7.42,46.27 v7.4,46.3 | v13.1,53.7 12.78,54.02 12.78,55.89 U1.31
  Bottom 0.254: v13.1,53.7 12.3,53.7 9.2,50.6 9.2,48.1 v7.4,46.3
V_BATT  (via drill 0.35)
  Top 0.254: C12.1 11.1,19.8 U$3.P$1 | Q1.3 9.4,20.3 v8.5,21.2 | R11.2 3,52.25 3.05,52.2 3.8,52.2 v4.1,51.9
  Top 0.406: U$5.3 18.38,23.88 C19.1 16.7,22.2 16.7,21.65 14.95,19.9 F2.2
  Bottom 0.254: v8.5,21.2 7.1,21.2 5.5,22.8 5.5,35.1 5.7,35.3 5.7,36.2 3.9,38 3.9,51.7 v4.1,51.9
  pour Top (no thermals): 15.8,20.8 8.9,20.8 8.9,19 15.8,19
  pour Top (no thermals): 14,16.2 16,16.2 16,19.8 14,19.8
  pour Top (no thermals): 14.6,20.8 15.7,20.8 16.6,21.7 16.6,22.6 17.9,22.6 17.9,21.5 15.6,19.2 14.6,20.2
VCC
  Top 0.254: U$1.3 6.44,23.14 6,22.7 4.5,22.7
  pour Top (no thermals): 7.7,18.5 3.2,18.5 3.2,19.8 7.7,19.8
  pour Top (no thermals): 3.6,19 3.6,21.7 1.2,21.7 1.2,24.7 4.7,24.7 4.7,22.2 5.6,22.2 5.6,19

### Text on the board
Top: Rev. 4. | 2020.05.17.
tNames: MOSI | MISO | SCK | Bypass | Reset | GND | 3.3V | SCL | SDA | 3.3V | GND
bNames: Node Module - 868MHz - Li-ion (Single Cell) / Arduino Compatible (Lillypad) / Analog/SDI/I2C/SPI | 1 | 2 | Florian Szekely / Agro Services & / Solutions Kft. | GND | 3.3V | 5V | SDI | A0 | A1 | A2 | A3